# EAGLE schematic Z80_BMO_V1.2 (EAGLE 6.6.0)
DRAWING_NUMBER: S002_B003; DRAWN: Mario Blunk / Blunk electronic; PROJECT: System TRAIN-Z
Assembly variants: com_anodes, com_cathode

## Sheet 1 of 12
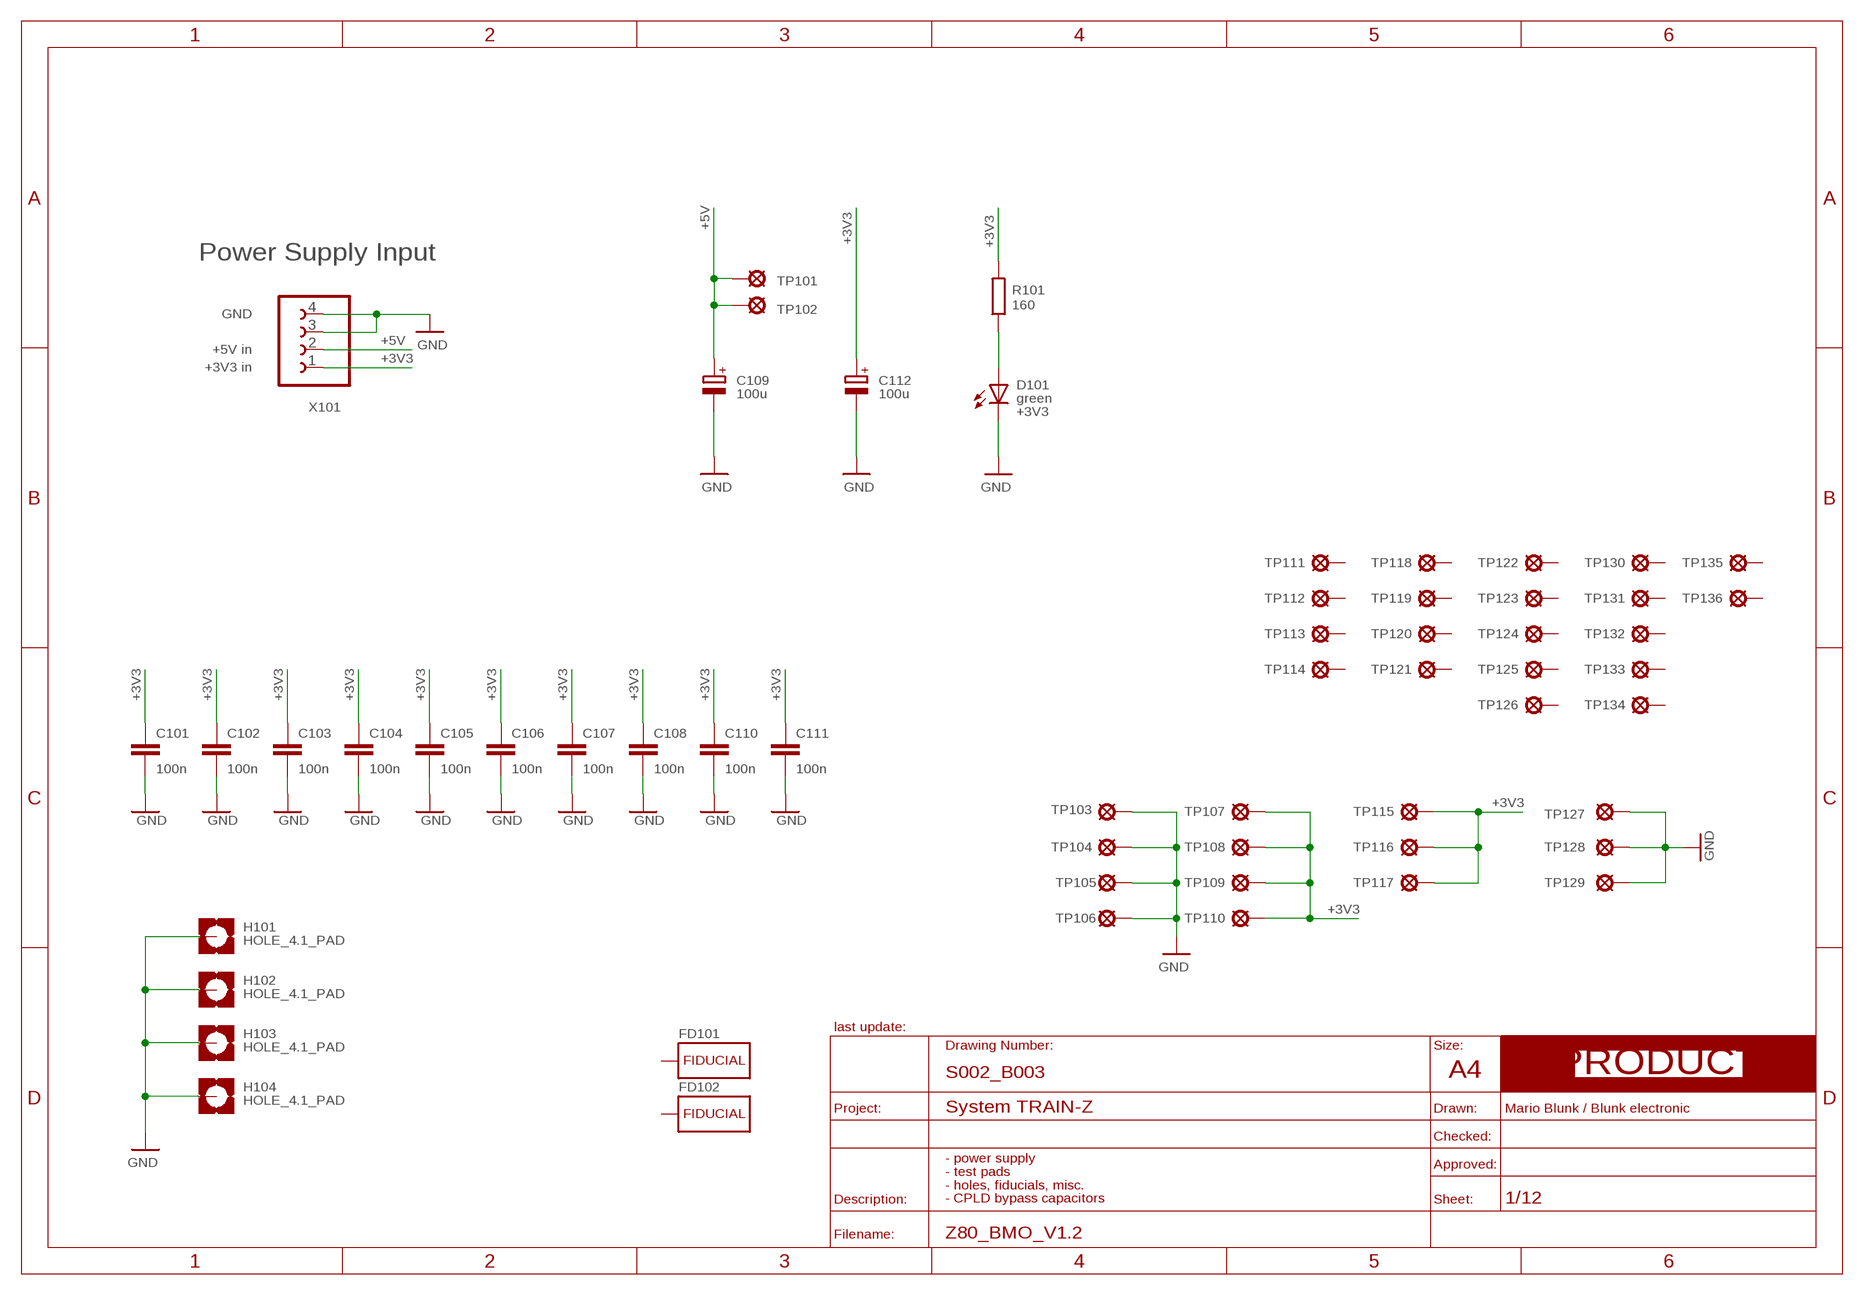
[diagram p0: schematic, sheet 1]
FRAME_PRODUCT1 (A4_LANDSCAPE_PRODUCT): BOM: NO; COMMISSIONED: 2013-08-30

### Parts
C101  100n  C_EU_S_0805  [S_0805]
C102  100n  C_EU_S_0805  [S_0805]
C103  100n  C_EU_S_0805  [S_0805]
C104  100n  C_EU_S_0805  [S_0805]
C105  100n  C_EU_S_0805  [S_0805]
C106  100n  C_EU_S_0805  [S_0805]
C107  100n  C_EU_S_0805  [S_0805]
C108  100n  C_EU_S_0805  [S_0805]
C109  100u  C_POL_EU_T_RAD7_GR2.54  [T_RADIAL_7MM_GRID_2.54MM]  (not fitted in variant com_anodes)  (not fitted in variant com_cathode)
C110  100n  C_EU_S_0805  [S_0805]
C111  100n  C_EU_S_0805  [S_0805]
C112  100u  C_POL_EU_T_RAD7_GR2.54  [T_RADIAL_7MM_GRID_2.54MM]
D101  green  LED_T_3MM  [T_LED_3MM]
FD101  FIDUCIAL_CROSSHAIR  [CROSSHAIR]
FD102  FIDUCIAL_CROSSHAIR  [CROSSHAIR]
H101  HOLE_4.1_PAD  [4.1_PAD]
H102  HOLE_4.1_PAD  [4.1_PAD]
H103  HOLE_4.1_PAD  [4.1_PAD]
H104  HOLE_4.1_PAD  [4.1_PAD]
R101  160  R_EU_T_0207_GRID10MM  [T_0207_GRID10MM]
TP101  TEST_POINT_T_SMALL  [T_TEST_POINT_SMALL]
TP102  TEST_POINT_T_SMALL  [T_TEST_POINT_SMALL]
TP103  TEST_POINT_T_SMALL  [T_TEST_POINT_SMALL]
TP104  TEST_POINT_T_SMALL  [T_TEST_POINT_SMALL]
TP105  TEST_POINT_T_SMALL  [T_TEST_POINT_SMALL]
TP106  TEST_POINT_T_SMALL  [T_TEST_POINT_SMALL]
TP107  TEST_POINT_T_SMALL  [T_TEST_POINT_SMALL]
TP108  TEST_POINT_T_SMALL  [T_TEST_POINT_SMALL]
TP109  TEST_POINT_T_SMALL  [T_TEST_POINT_SMALL]
TP110  TEST_POINT_T_SMALL  [T_TEST_POINT_SMALL]
TP111  TEST_POINT_T_SMALL  [T_TEST_POINT_SMALL]
TP112  TEST_POINT_T_SMALL  [T_TEST_POINT_SMALL]
TP113  TEST_POINT_T_SMALL  [T_TEST_POINT_SMALL]
TP114  TEST_POINT_T_SMALL  [T_TEST_POINT_SMALL]
TP115  TEST_POINT_T_SMALL  [T_TEST_POINT_SMALL]
TP116  TEST_POINT_T_SMALL  [T_TEST_POINT_SMALL]
TP117  TEST_POINT_T_SMALL  [T_TEST_POINT_SMALL]
TP118  TEST_POINT_T_SMALL  [T_TEST_POINT_SMALL]
TP119  TEST_POINT_T_SMALL  [T_TEST_POINT_SMALL]
TP120  TEST_POINT_T_SMALL  [T_TEST_POINT_SMALL]
TP121  TEST_POINT_T_SMALL  [T_TEST_POINT_SMALL]
TP122  TEST_POINT_T_SMALL  [T_TEST_POINT_SMALL]
TP123  TEST_POINT_T_SMALL  [T_TEST_POINT_SMALL]
TP124  TEST_POINT_T_SMALL  [T_TEST_POINT_SMALL]
TP125  TEST_POINT_T_SMALL  [T_TEST_POINT_SMALL]
TP126  TEST_POINT_T_SMALL  [T_TEST_POINT_SMALL]
TP127  TEST_POINT_T_SMALL  [T_TEST_POINT_SMALL]
TP128  TEST_POINT_T_SMALL  [T_TEST_POINT_SMALL]
TP129  TEST_POINT_T_SMALL  [T_TEST_POINT_SMALL]
TP130  TEST_POINT_T_SMALL  [T_TEST_POINT_SMALL]
TP131  TEST_POINT_T_SMALL  [T_TEST_POINT_SMALL]
TP132  TEST_POINT_T_SMALL  [T_TEST_POINT_SMALL]
TP133  TEST_POINT_T_SMALL  [T_TEST_POINT_SMALL]
TP134  TEST_POINT_T_SMALL  [T_TEST_POINT_SMALL]
TP135  TEST_POINT_T_SMALL  [T_TEST_POINT_SMALL]
TP136  TEST_POINT_T_SMALL  [T_TEST_POINT_SMALL]
X101  CLAMP_1X4-T-5MM  [T_WIRE_CLAMP_1X4_5MM]

### Nets
3V3_LED_A: D101.A R101.1
+3V3: C101.1 C102.1 C103.1 C104.1 C105.1 C106.1 C107.1 C108.1 C110.1 C111.1 C112.+ R101.2 TP107.1(MP) TP108.1(MP) TP109.1(MP) TP110.1(MP) TP115.1(MP) TP116.1(MP) TP117.1(MP) X101.1 ; also sheet 2,4,5,6,7,8,9,10,11,12
+5V: C109.+ TP101.1(MP) TP102.1(MP) X101.2
GND: C101.2 C102.2 C103.2 C104.2 C105.2 C106.2 C107.2 C108.2 C109.- C110.2 C111.2 C112.- D101.C H101.H1(MOUNT) H102.H1(MOUNT) H103.H1(MOUNT) H104.H1(MOUNT) TP103.1(MP) TP104.1(MP) TP105.1(MP) TP106.1(MP) TP127.1(MP) TP128.1(MP) TP129.1(MP) X101.3 X101.4 ; also sheet 2,5,6,7,8,9,10,11,12
Unconnected: FD101.1(NC) FD102.1(NC) TP111.1(MP) TP112.1(MP) TP113.1(MP) TP114.1(MP) TP118.1(MP) TP119.1(MP) TP120.1(MP) TP121.1(MP) TP122.1(MP) TP123.1(MP) TP124.1(MP) TP125.1(MP) TP126.1(MP) TP130.1(MP) TP131.1(MP) TP132.1(MP) TP133.1(MP) TP134.1(MP) TP135.1(MP) TP136.1(MP)

### Notes on the sheet
- GND
- +5V in
- +3V3 in
- - power supply
  - test pads
  - holes, fiducials, misc.
  - CPLD bypass capacitors

## Sheet 2 of 12
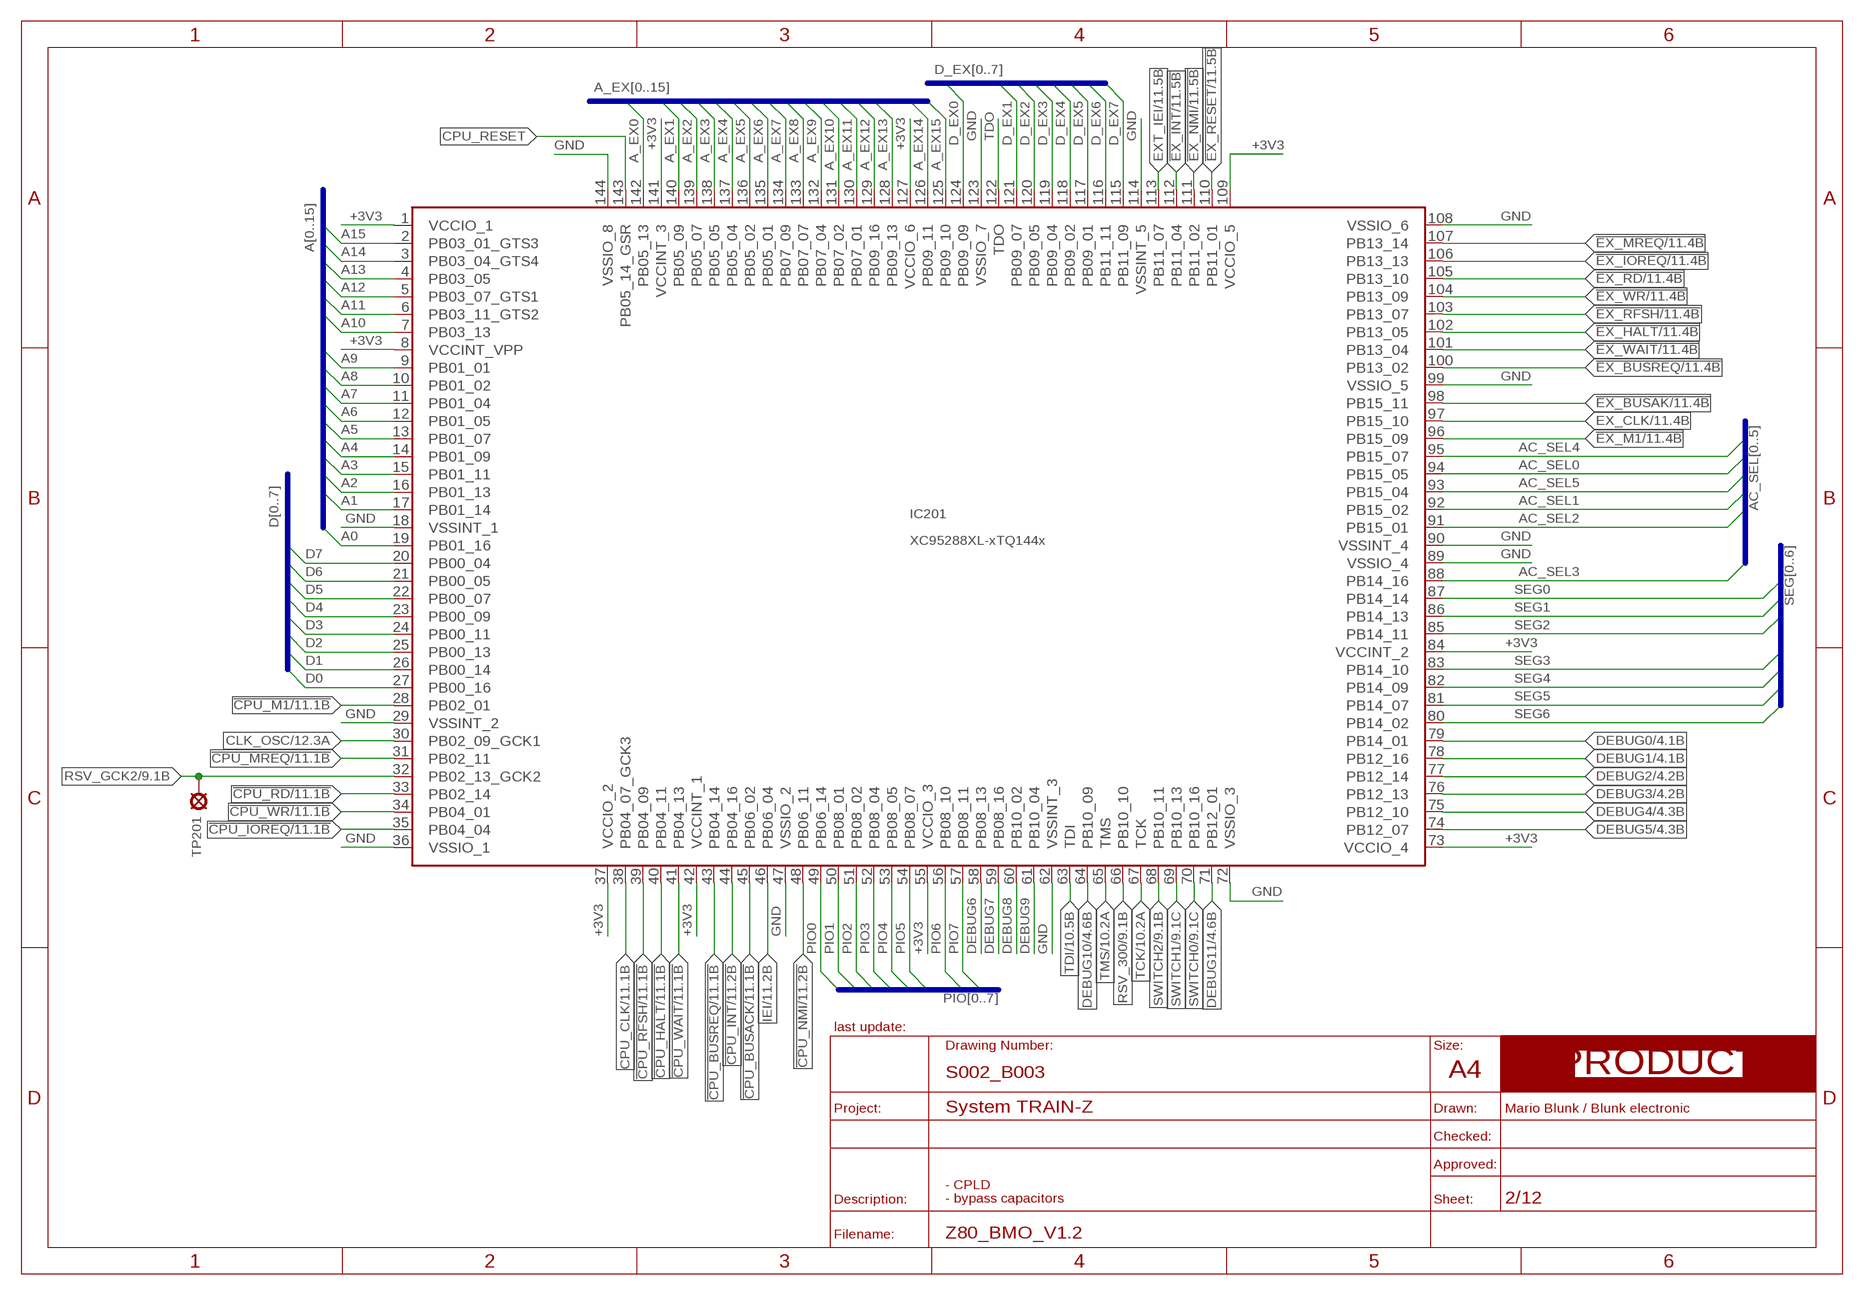
[diagram p1: schematic, sheet 2]
FRAME_PRODUCT4 (A4_LANDSCAPE_PRODUCT): BOM: NO; COMMISSIONED: 2013-08-30

### Parts
IC201  XC95288XL-xTQ144x  XC95288XL-TQG144  [S_TQFP144]
TP201  TEST_POINT_T_SMALL  [T_TEST_POINT_SMALL]

### Nets
!CPU_BUSACK: IC201.45(PB06_02) ; also sheet 11
!CPU_BUSREQ: IC201.43(PB04_14) ; also sheet 11
!CPU_HALT: IC201.40(PB04_11) ; also sheet 11
!CPU_INT: IC201.44(PB04_16) ; also sheet 11
!CPU_IOREQ: IC201.35(PB04_04) ; also sheet 11
!CPU_M1: IC201.28(PB02_01) ; also sheet 11
!CPU_MREQ: IC201.31(PB02_11) ; also sheet 11
!CPU_NMI: IC201.48(PB06_11) ; also sheet 11
!CPU_RD: IC201.33(PB02_14) ; also sheet 11
!CPU_RFSH: IC201.39(PB04_09) ; also sheet 11
!CPU_WAIT: IC201.41(PB04_13) ; also sheet 11
!CPU_WR: IC201.34(PB04_01) ; also sheet 11
!EX_BUSAK: IC201.98(PB15_11) ; also sheet 11
!EX_BUSREQ: IC201.100(PB13_02) ; also sheet 11
!EX_HALT: IC201.102(PB13_05) ; also sheet 11
!EX_INT: IC201.112(PB11_04) ; also sheet 11
!EX_IOREQ: IC201.106(PB13_13) ; also sheet 11
!EX_M1: IC201.96(PB15_09) ; also sheet 11
!EX_MREQ: IC201.107(PB13_14) ; also sheet 11
!EX_NMI: IC201.111(PB11_02) ; also sheet 11
!EX_RD: IC201.105(PB13_10) ; also sheet 11
!EX_RESET: IC201.110(PB11_01) ; also sheet 11
!EX_RFSH: IC201.103(PB13_07) ; also sheet 11
!EX_WAIT: IC201.101(PB13_04) ; also sheet 11
!EX_WR: IC201.104(PB13_09) ; also sheet 11
+3V3: IC201.1(VCCIO_1) IC201.8(VCCINT_VPP) IC201.37(VCCIO_2) IC201.42(VCCINT_1) IC201.55(VCCIO_3) IC201.73(VCCIO_4) IC201.84(VCCINT_2) IC201.109(VCCIO_5) IC201.127(VCCIO_6) IC201.141(VCCINT_3) ; also sheet 1,4,5,6,7,8,9,10,11,12
A0: IC201.19(PB01_16) ; also sheet 11
A1: IC201.17(PB01_14) ; also sheet 11
A2: IC201.16(PB01_13) ; also sheet 11
A3: IC201.15(PB01_11) ; also sheet 11
A4: IC201.14(PB01_09) ; also sheet 11
A5: IC201.13(PB01_07) ; also sheet 11
A6: IC201.12(PB01_05) ; also sheet 11
A7: IC201.11(PB01_04) ; also sheet 11
A8: IC201.10(PB01_02) ; also sheet 11
A9: IC201.9(PB01_01) ; also sheet 11
A10: IC201.7(PB03_13) ; also sheet 11
A11: IC201.6(PB03_11_GTS2) ; also sheet 11
A12: IC201.5(PB03_07_GTS1) ; also sheet 11
A13: IC201.4(PB03_05) ; also sheet 11
A14: IC201.3(PB03_04_GTS4) ; also sheet 11
A15: IC201.2(PB03_01_GTS3) ; also sheet 11
A_EX0: IC201.142(PB05_13) ; also sheet 11
A_EX1: IC201.140(PB05_09) ; also sheet 11
A_EX2: IC201.139(PB05_07) ; also sheet 11
A_EX3: IC201.138(PB05_05) ; also sheet 11
A_EX4: IC201.137(PB05_04) ; also sheet 11
A_EX5: IC201.136(PB05_02) ; also sheet 11
A_EX6: IC201.135(PB05_01) ; also sheet 11
A_EX7: IC201.134(PB07_09) ; also sheet 11
A_EX8: IC201.133(PB07_07) ; also sheet 11
A_EX9: IC201.132(PB07_04) ; also sheet 11
A_EX10: IC201.131(PB07_02) ; also sheet 11
A_EX11: IC201.130(PB07_01) ; also sheet 11
A_EX12: IC201.129(PB09_16) ; also sheet 11
A_EX13: IC201.128(PB09_13) ; also sheet 11
A_EX14: IC201.126(PB09_11) ; also sheet 11
A_EX15: IC201.125(PB09_10) ; also sheet 11
AC_SEL0: IC201.94(PB15_05) ; also sheet 8
AC_SEL1: IC201.92(PB15_02) ; also sheet 8
AC_SEL2: IC201.91(PB15_01) ; also sheet 8
AC_SEL3: IC201.88(PB14_16) ; also sheet 7
AC_SEL4: IC201.95(PB15_07) ; also sheet 7
AC_SEL5: IC201.93(PB15_04) ; also sheet 7
CLK_OSC: IC201.30(PB02_09_GCK1) ; also sheet 12
CPU_CLK: IC201.38(PB04_07_GCK3) ; also sheet 11
CPU_RESET: IC201.143(PB05_14_GSR) ; also sheet 11
D0: IC201.27(PB00_16) ; also sheet 11
D1: IC201.26(PB00_14) ; also sheet 11
D2: IC201.25(PB00_13) ; also sheet 11
D3: IC201.24(PB00_11) ; also sheet 11
D4: IC201.23(PB00_09) ; also sheet 11
D5: IC201.22(PB00_07) ; also sheet 11
D6: IC201.21(PB00_05) ; also sheet 11
D7: IC201.20(PB00_04) ; also sheet 11
D_EX0: IC201.124(PB09_09) ; also sheet 11
D_EX1: IC201.121(PB09_07) ; also sheet 11
D_EX2: IC201.120(PB09_05) ; also sheet 11
D_EX3: IC201.119(PB09_04) ; also sheet 11
D_EX4: IC201.118(PB09_02) ; also sheet 11
D_EX5: IC201.117(PB09_01) ; also sheet 11
D_EX6: IC201.116(PB11_11) ; also sheet 11
D_EX7: IC201.115(PB11_09) ; also sheet 11
DEBUG0: IC201.79(PB14_01) ; also sheet 4,9
DEBUG1: IC201.78(PB12_16) ; also sheet 4,9
DEBUG2: IC201.77(PB12_14) ; also sheet 4,9
DEBUG3: IC201.76(PB12_13) ; also sheet 4,9
DEBUG4: IC201.75(PB12_10) ; also sheet 4,9
DEBUG5: IC201.74(PB12_07) ; also sheet 4,9
DEBUG6: IC201.58(PB08_13) ; also sheet 4,9
DEBUG7: IC201.59(PB08_16) ; also sheet 4,9
DEBUG8: IC201.60(PB10_02) ; also sheet 4
DEBUG9: IC201.61(PB10_04) ; also sheet 4
DEBUG10: IC201.64(PB10_09) ; also sheet 4
DEBUG11: IC201.71(PB12_01) ; also sheet 4
EX_CLK: IC201.97(PB15_10) ; also sheet 11
EXT_IEI: IC201.113(PB11_07) ; also sheet 11
GND: IC201.18(VSSINT_1) IC201.29(VSSINT_2) IC201.36(VSSIO_1) IC201.47(VSSIO_2) IC201.62(VSSINT_3) IC201.72(VSSIO_3) IC201.89(VSSIO_4) IC201.90(VSSINT_4) IC201.99(VSSIO_5) IC201.108(VSSIO_6) IC201.114(VSSINT_5) IC201.123(VSSIO_7) IC201.144(VSSIO_8) ; also sheet 1,5,6,7,8,9,10,11,12
IEI: IC201.46(PB06_04) ; also sheet 11
PIO0: IC201.49(PB06_14) ; also sheet 9
PIO1: IC201.50(PB08_01) ; also sheet 9
PIO2: IC201.51(PB08_02) ; also sheet 9
PIO3: IC201.52(PB08_04) ; also sheet 9
PIO4: IC201.53(PB08_05) ; also sheet 9
PIO5: IC201.54(PB08_07) ; also sheet 9
PIO6: IC201.56(PB08_10) ; also sheet 9
PIO7: IC201.57(PB08_11) ; also sheet 9
RSV_300: IC201.66(PB10_10) ; also sheet 9
RSV_GCK2: IC201.32(PB02_13_GCK2) TP201.1(MP) ; also sheet 9
SEG0: IC201.87(PB14_14) ; also sheet 5
SEG1: IC201.86(PB14_13) ; also sheet 5
SEG2: IC201.85(PB14_11) ; also sheet 5
SEG3: IC201.83(PB14_10) ; also sheet 5
SEG4: IC201.82(PB14_09) ; also sheet 6
SEG5: IC201.81(PB14_07) ; also sheet 6
SEG6: IC201.80(PB14_02) ; also sheet 6
SWITCH0: IC201.70(PB10_16) ; also sheet 9
SWITCH1: IC201.69(PB10_13) ; also sheet 9
SWITCH2: IC201.68(PB10_11) ; also sheet 9
TCK: IC201.67(TCK) ; also sheet 10
TDI: IC201.63(TDI) ; also sheet 10
TDO: IC201.122(TDO) ; also sheet 10
TMS: IC201.65(TMS) ; also sheet 10

### Buses
A[0..15]
D[0..7]
D_EX[0..7]
A_EX[0..15]
PIO[0..7]
SEG[0..6]
AC_SEL[0..5]

### Notes on the sheet
- - CPLD
  - bypass capacitors

## Sheet 3 of 12
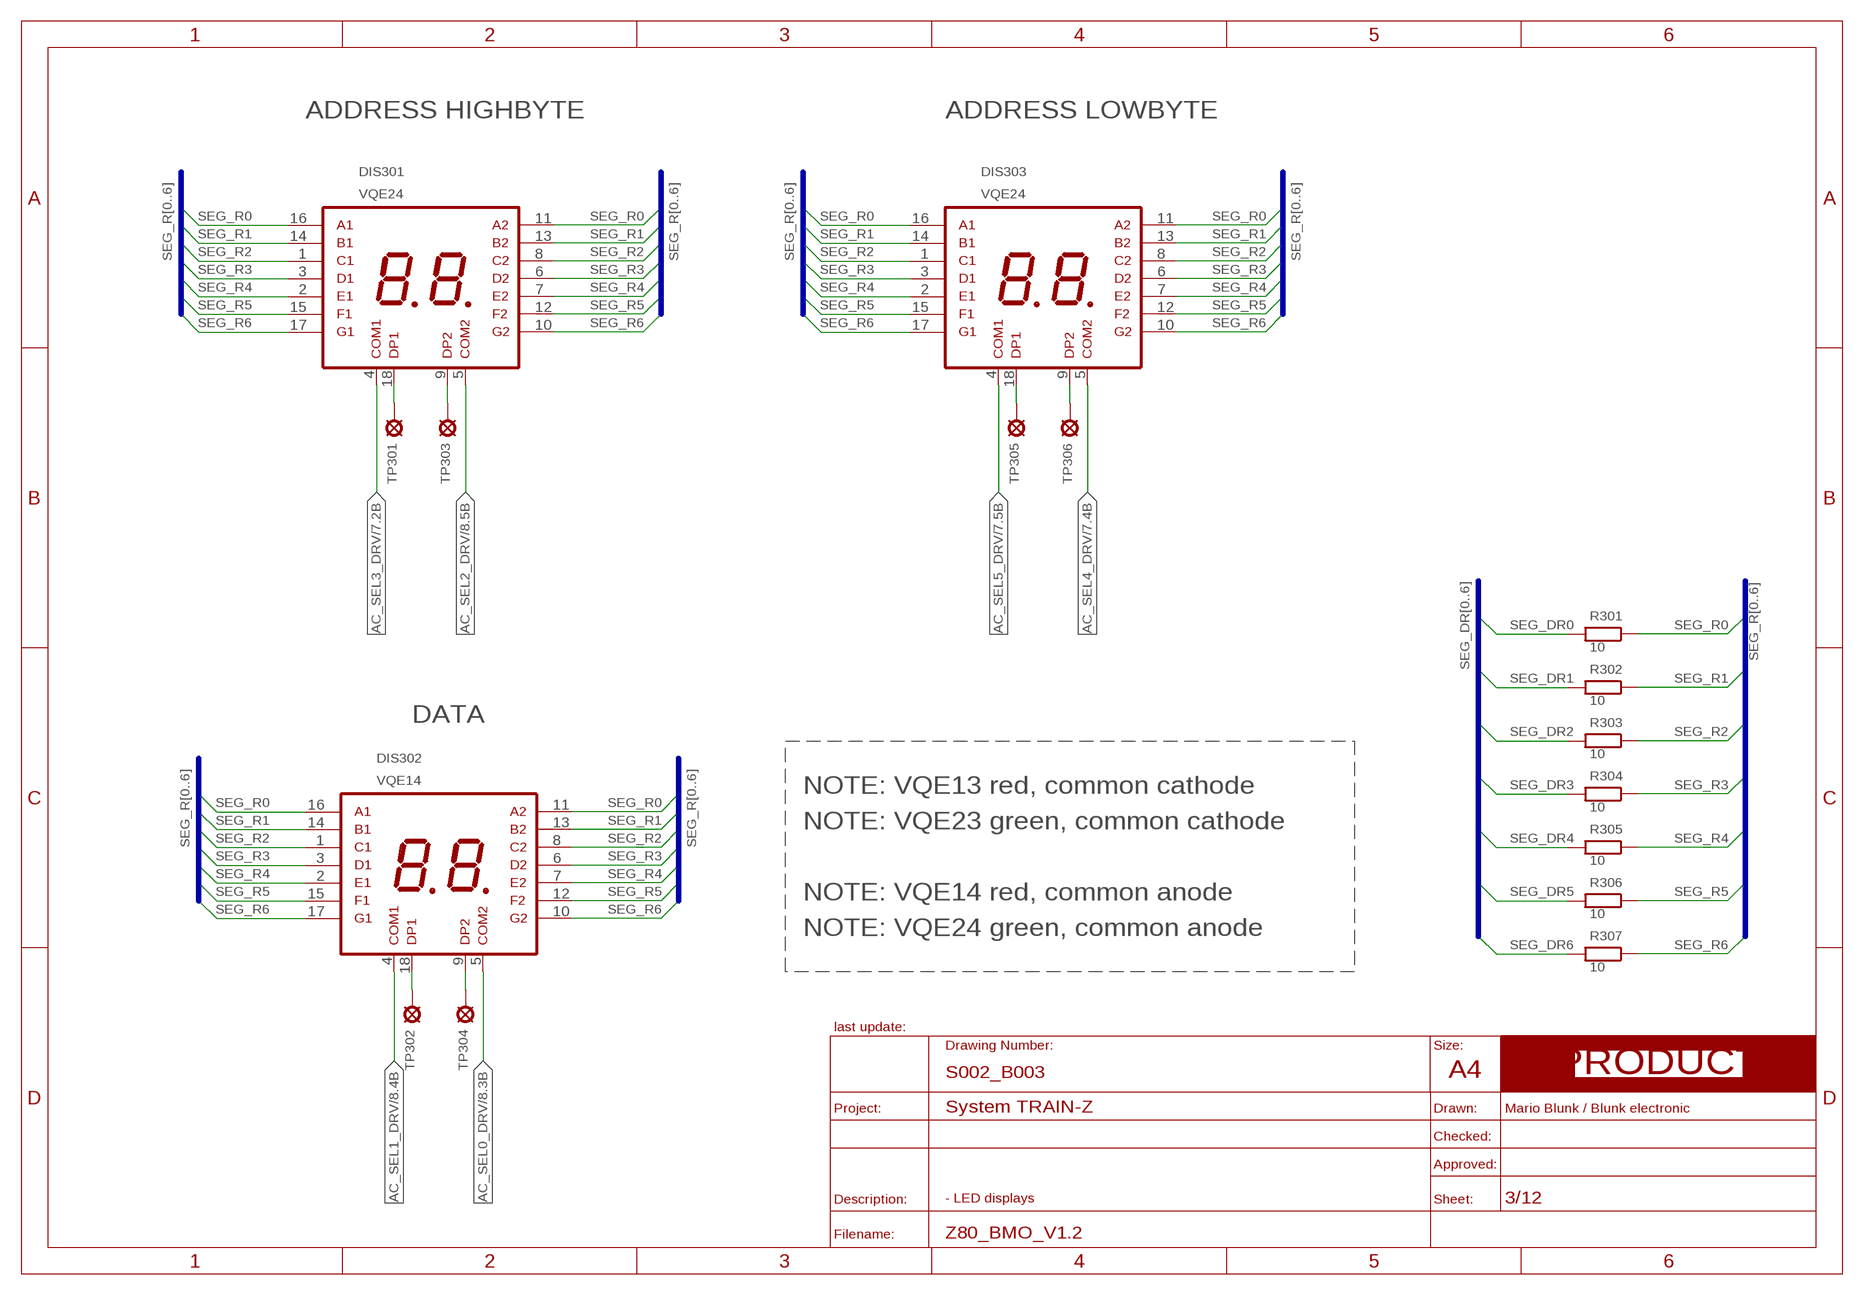
[diagram p2: schematic, sheet 3]
FRAME_PRODUCT5 (A4_LANDSCAPE_PRODUCT): BOM: NO; COMMISSIONED: 2013-08-30

### Parts
DIS301  VQE24  VQEXX_2DIGIT_T_VQEXX_2DIGIT  [T_VQE_XX_2DIGIT]
DIS302  VQE14  VQEXX_2DIGIT_T_VQEXX_2DIGIT  [T_VQE_XX_2DIGIT]
DIS303  VQE24  VQEXX_2DIGIT_T_VQEXX_2DIGIT  [T_VQE_XX_2DIGIT]
R301  10  R_EU_T_0207_GRID10MM  [T_0207_GRID10MM]
R302  10  R_EU_T_0207_GRID10MM  [T_0207_GRID10MM]
R303  10  R_EU_T_0207_GRID10MM  [T_0207_GRID10MM]
R304  10  R_EU_T_0207_GRID10MM  [T_0207_GRID10MM]
R305  10  R_EU_T_0207_GRID10MM  [T_0207_GRID10MM]
R306  10  R_EU_T_0207_GRID10MM  [T_0207_GRID10MM]
R307  10  R_EU_T_0207_GRID10MM  [T_0207_GRID10MM]
TP301  TEST_POINT_T_SMALL  [T_TEST_POINT_SMALL]
TP302  TEST_POINT_T_SMALL  [T_TEST_POINT_SMALL]
TP303  TEST_POINT_T_SMALL  [T_TEST_POINT_SMALL]
TP304  TEST_POINT_T_SMALL  [T_TEST_POINT_SMALL]
TP305  TEST_POINT_T_SMALL  [T_TEST_POINT_SMALL]
TP306  TEST_POINT_T_SMALL  [T_TEST_POINT_SMALL]

### Nets
AC_SEL0_DRV [PWR]: DIS302.5(COM2) ; also sheet 8
AC_SEL1_DRV [PWR]: DIS302.4(COM1) ; also sheet 8
AC_SEL2_DRV [PWR]: DIS301.5(COM2) ; also sheet 8
AC_SEL3_DRV [PWR]: DIS301.4(COM1) ; also sheet 7
AC_SEL4_DRV [PWR]: DIS303.5(COM2) ; also sheet 7
AC_SEL5_DRV [PWR]: DIS303.4(COM1) ; also sheet 7
N$1: DIS303.9(DP2) TP306.1(MP)
N$2: DIS303.18(DP1) TP305.1(MP)
N$3: DIS301.9(DP2) TP303.1(MP)
N$4: DIS301.18(DP1) TP301.1(MP)
N$5: DIS302.9(DP2) TP304.1(MP)
N$6: DIS302.18(DP1) TP302.1(MP)
SEG_DR0: R301.2 ; also sheet 5
SEG_DR1: R302.2 ; also sheet 5
SEG_DR2: R303.2 ; also sheet 5
SEG_DR3: R304.2 ; also sheet 5
SEG_DR4: R305.2 ; also sheet 6
SEG_DR5: R306.2 ; also sheet 6
SEG_DR6: R307.2 ; also sheet 6
SEG_R0: DIS301.11(A2) DIS301.16(A1) DIS302.11(A2) DIS302.16(A1) DIS303.11(A2) DIS303.16(A1) R301.1
SEG_R1: DIS301.13(B2) DIS301.14(B1) DIS302.13(B2) DIS302.14(B1) DIS303.13(B2) DIS303.14(B1) R302.1
SEG_R2: DIS301.1(C1) DIS301.8(C2) DIS302.1(C1) DIS302.8(C2) DIS303.1(C1) DIS303.8(C2) R303.1
SEG_R3: DIS301.3(D1) DIS301.6(D2) DIS302.3(D1) DIS302.6(D2) DIS303.3(D1) DIS303.6(D2) R304.1
SEG_R4: DIS301.2(E1) DIS301.7(E2) DIS302.2(E1) DIS302.7(E2) DIS303.2(E1) DIS303.7(E2) R305.1
SEG_R5: DIS301.12(F2) DIS301.15(F1) DIS302.12(F2) DIS302.15(F1) DIS303.12(F2) DIS303.15(F1) R306.1
SEG_R6: DIS301.10(G2) DIS301.17(G1) DIS302.10(G2) DIS302.17(G1) DIS303.10(G2) DIS303.17(G1) R307.1

### Buses
SEG_R[0..6]
SEG_DR[0..6]

### Notes on the sheet
- ADDRESS HIGHBYTE | ADDRESS LOWBYTE
- DATA
- NOTE: VQE13 red, common cathode
- NOTE: VQE23 green, common cathode
- NOTE: VQE14 red, common anode
- NOTE: VQE24 green, common anode
- - LED displays

## Sheet 4 of 12
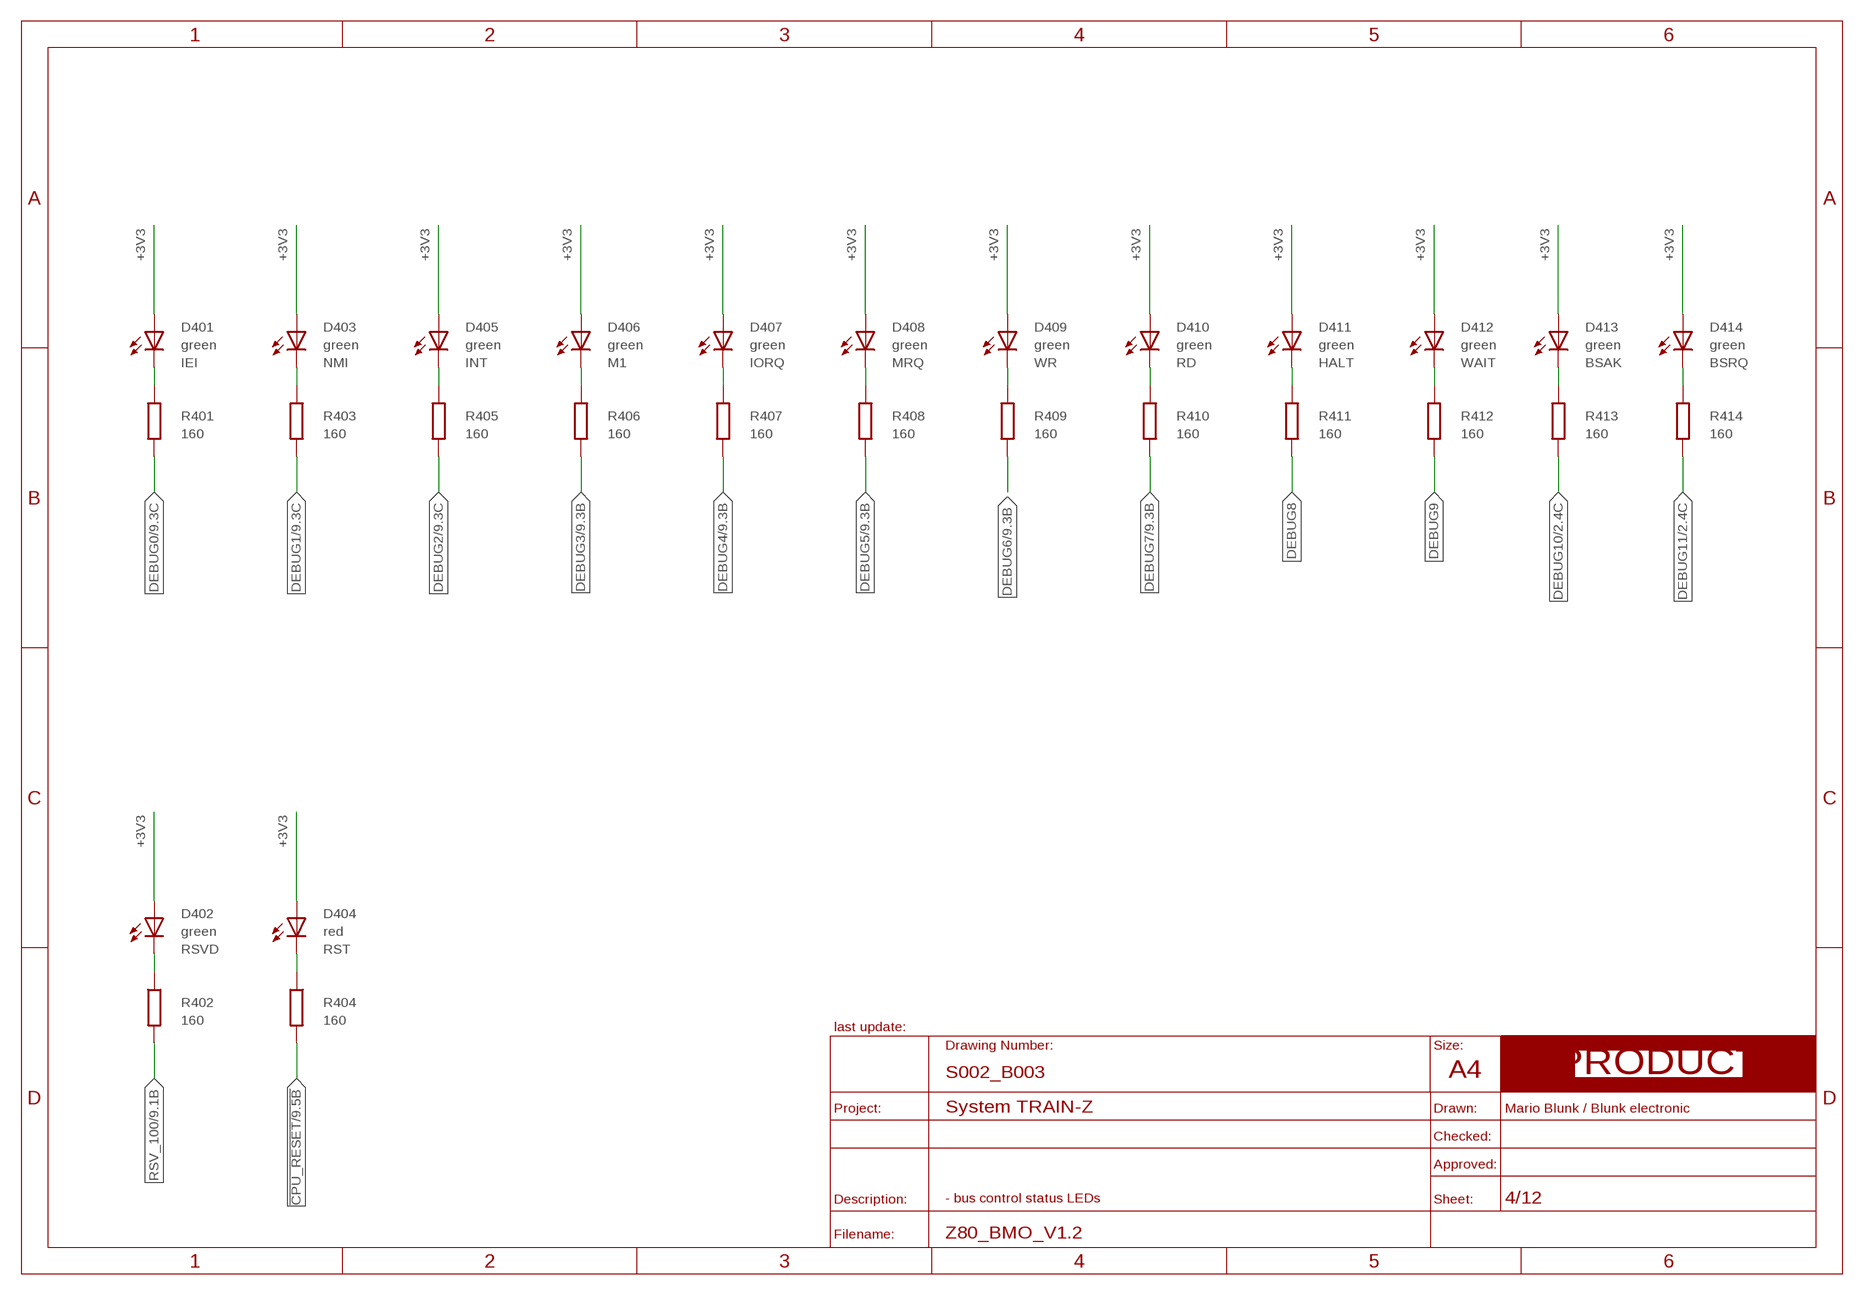
[diagram p3: schematic, sheet 4]
FRAME_PRODUCT6 (A4_LANDSCAPE_PRODUCT): BOM: NO; COMMISSIONED: 2013-08-30

### Parts
D401  green  LED_T_3MM  [T_LED_3MM]
D402  green  LED_T_3MM  [T_LED_3MM]
D403  green  LED_T_3MM  [T_LED_3MM]
D404  red  LED_T_3MM  [T_LED_3MM]
D405  green  LED_T_3MM  [T_LED_3MM]
D406  green  LED_T_3MM  [T_LED_3MM]
D407  green  LED_T_3MM  [T_LED_3MM]
D408  green  LED_T_3MM  [T_LED_3MM]
D409  green  LED_T_3MM  [T_LED_3MM]
D410  green  LED_T_3MM  [T_LED_3MM]
D411  green  LED_T_3MM  [T_LED_3MM]
D412  green  LED_T_3MM  [T_LED_3MM]
D413  green  LED_T_3MM  [T_LED_3MM]
D414  green  LED_T_3MM  [T_LED_3MM]
R401  160  R_EU_T_0207_GRID10MM  [T_0207_GRID10MM]
R402  160  R_EU_T_0207_GRID10MM  [T_0207_GRID10MM]
R403  160  R_EU_T_0207_GRID10MM  [T_0207_GRID10MM]
R404  160  R_EU_T_0207_GRID10MM  [T_0207_GRID10MM]
R405  160  R_EU_T_0207_GRID10MM  [T_0207_GRID10MM]
R406  160  R_EU_T_0207_GRID10MM  [T_0207_GRID10MM]
R407  160  R_EU_T_0207_GRID10MM  [T_0207_GRID10MM]
R408  160  R_EU_T_0207_GRID10MM  [T_0207_GRID10MM]
R409  160  R_EU_T_0207_GRID10MM  [T_0207_GRID10MM]
R410  160  R_EU_T_0207_GRID10MM  [T_0207_GRID10MM]
R411  160  R_EU_T_0207_GRID10MM  [T_0207_GRID10MM]
R412  160  R_EU_T_0207_GRID10MM  [T_0207_GRID10MM]
R413  160  R_EU_T_0207_GRID10MM  [T_0207_GRID10MM]
R414  160  R_EU_T_0207_GRID10MM  [T_0207_GRID10MM]

### Nets
!CPU_RESET: R404.2 ; also sheet 9,11
+3V3: D401.A D402.A D403.A D404.A D405.A D406.A D407.A D408.A D409.A D410.A D411.A D412.A D413.A D414.A ; also sheet 1,2,5,6,7,8,9,10,11,12
DEBUG0: R401.2 ; also sheet 2,9
DEBUG0_LED: D401.C R401.1
DEBUG1: R403.2 ; also sheet 2,9
DEBUG1_LED: D403.C R403.1
DEBUG2: R405.2 ; also sheet 2,9
DEBUG2_LED: D405.C R405.1
DEBUG3: R406.2 ; also sheet 2,9
DEBUG3_LED: D406.C R406.1
DEBUG4: R407.2 ; also sheet 2,9
DEBUG4_LED: D407.C R407.1
DEBUG5: R408.2 ; also sheet 2,9
DEBUG5_LED: D408.C R408.1
DEBUG6: R409.2 ; also sheet 2,9
DEBUG6_LED: D409.C R409.1
DEBUG7: R410.2 ; also sheet 2,9
DEBUG7_LED: D410.C R410.1
DEBUG8: R411.2 ; also sheet 2
DEBUG8_LED: D411.C R411.1
DEBUG9: R412.2 ; also sheet 2
DEBUG9_LED: D412.C R412.1
DEBUG10: R413.2 ; also sheet 2
DEBUG10_LED: D413.C R413.1
DEBUG11: R414.2 ; also sheet 2
DEBUG11_LED: D414.C R414.1
RST_LED_C: D404.C R404.1
RSV_100: R402.2 ; also sheet 9
RSV_100_LED: D402.C R402.1

### Notes on the sheet
- - bus control status LEDs

## Sheet 5 of 12
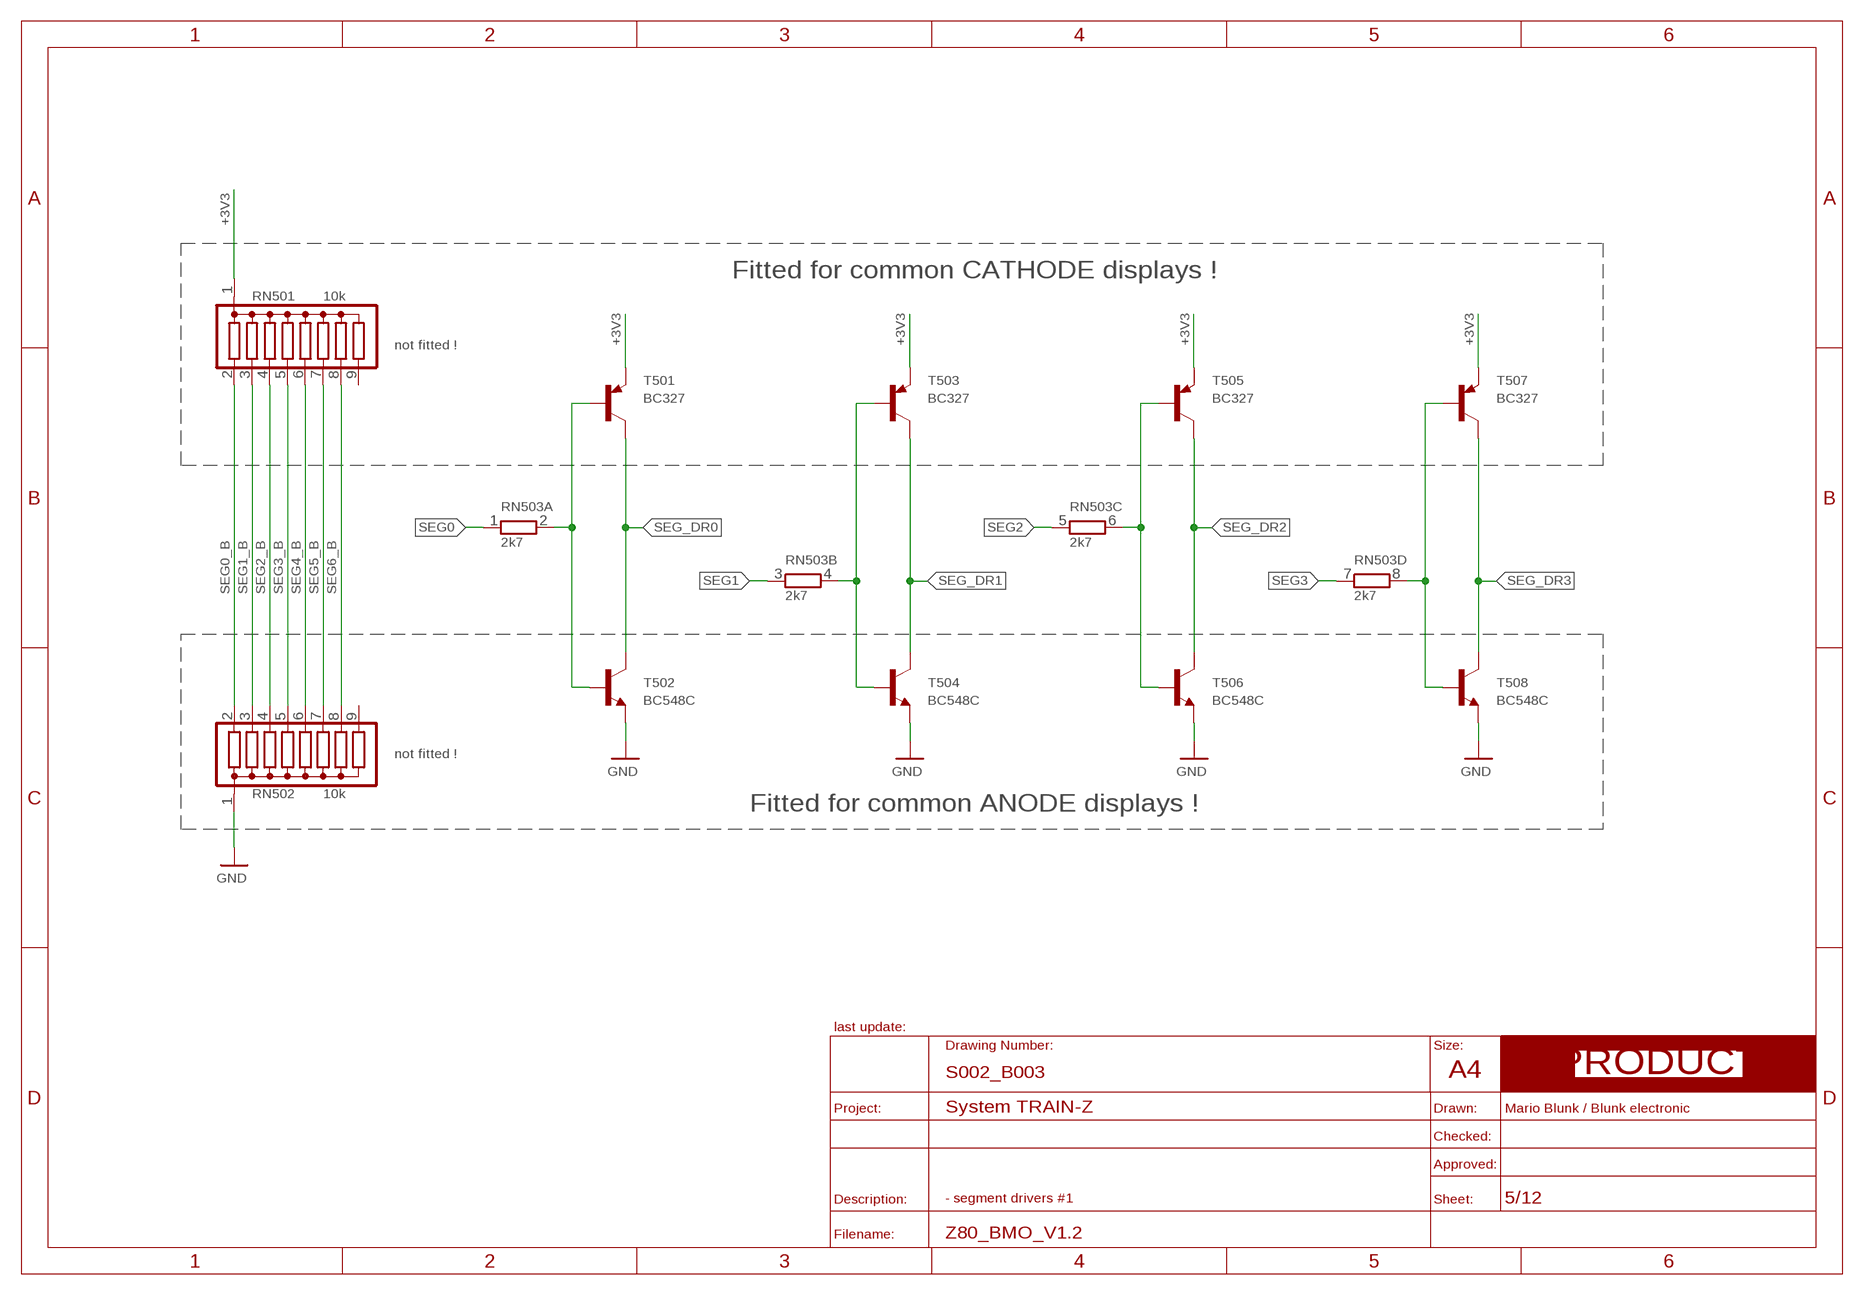
[diagram p4: schematic, sheet 5]
FRAME_PRODUCT8 (A4_LANDSCAPE_PRODUCT): BOM: NO; COMMISSIONED: 2013-08-30

### Parts
RN501  10k  R_EU_ARRAY_1C_8_T_SIL9  [T_SIL9]  (not fitted in variant com_anodes)  (not fitted in variant com_cathode)
RN502  10k  R_EU_ARRAY_1C_8_T_SIL9  [T_SIL9]  (not fitted in variant com_anodes)  (not fitted in variant com_cathode)
RN503  2k7  R_EU_ARRAY_4  [T_SIL8]
T501  BC327  PNP_T_TO92-CBE  [T_TO92-CBE]  (not fitted in variant com_anodes)
T502  BC548C  NPN_T_TO92-CBE  [T_TO92-CBE]  (not fitted in variant com_cathode)
T503  BC327  PNP_T_TO92-CBE  [T_TO92-CBE]  (not fitted in variant com_anodes)
T504  BC548C  NPN_T_TO92-CBE  [T_TO92-CBE]  (not fitted in variant com_cathode)
T505  BC327  PNP_T_TO92-CBE  [T_TO92-CBE]  (not fitted in variant com_anodes)
T506  BC548C  NPN_T_TO92-CBE  [T_TO92-CBE]  (not fitted in variant com_cathode)
T507  BC327  PNP_T_TO92-CBE  [T_TO92-CBE]  (not fitted in variant com_anodes)
T508  BC548C  NPN_T_TO92-CBE  [T_TO92-CBE]  (not fitted in variant com_cathode)

### Nets
+3V3: RN501.1 T501.E T503.E T505.E T507.E ; also sheet 1,2,4,6,7,8,9,10,11,12
GND: RN502.1 T502.E T504.E T506.E T508.E ; also sheet 1,2,6,7,8,9,10,11,12
SEG0: RN503.1 ; also sheet 2
SEG0_B: RN501.2 RN502.2 RN503.2 T501.B T502.B
SEG1: RN503.3 ; also sheet 2
SEG1_B: RN501.3 RN502.3 RN503.4 T503.B T504.B
SEG2: RN503.5 ; also sheet 2
SEG2_B: RN501.4 RN502.4 RN503.6 T505.B T506.B
SEG3: RN503.7 ; also sheet 2
SEG3_B: RN501.5 RN502.5 RN503.8 T507.B T508.B
SEG4_B: RN501.6 RN502.6 ; also sheet 6
SEG5_B: RN501.7 RN502.7 ; also sheet 6
SEG6_B: RN501.8 RN502.8 ; also sheet 6
SEG_DR0: T501.C T502.C ; also sheet 3
SEG_DR1: T503.C T504.C ; also sheet 3
SEG_DR2: T505.C T506.C ; also sheet 3
SEG_DR3: T507.C T508.C ; also sheet 3
Unconnected: RN501.9 RN502.9

### Notes on the sheet
- Fitted for common CATHODE displays !
- not fitted !
- not fitted !
- Fitted for common ANODE displays !
- - segment drivers #1

## Sheet 6 of 12
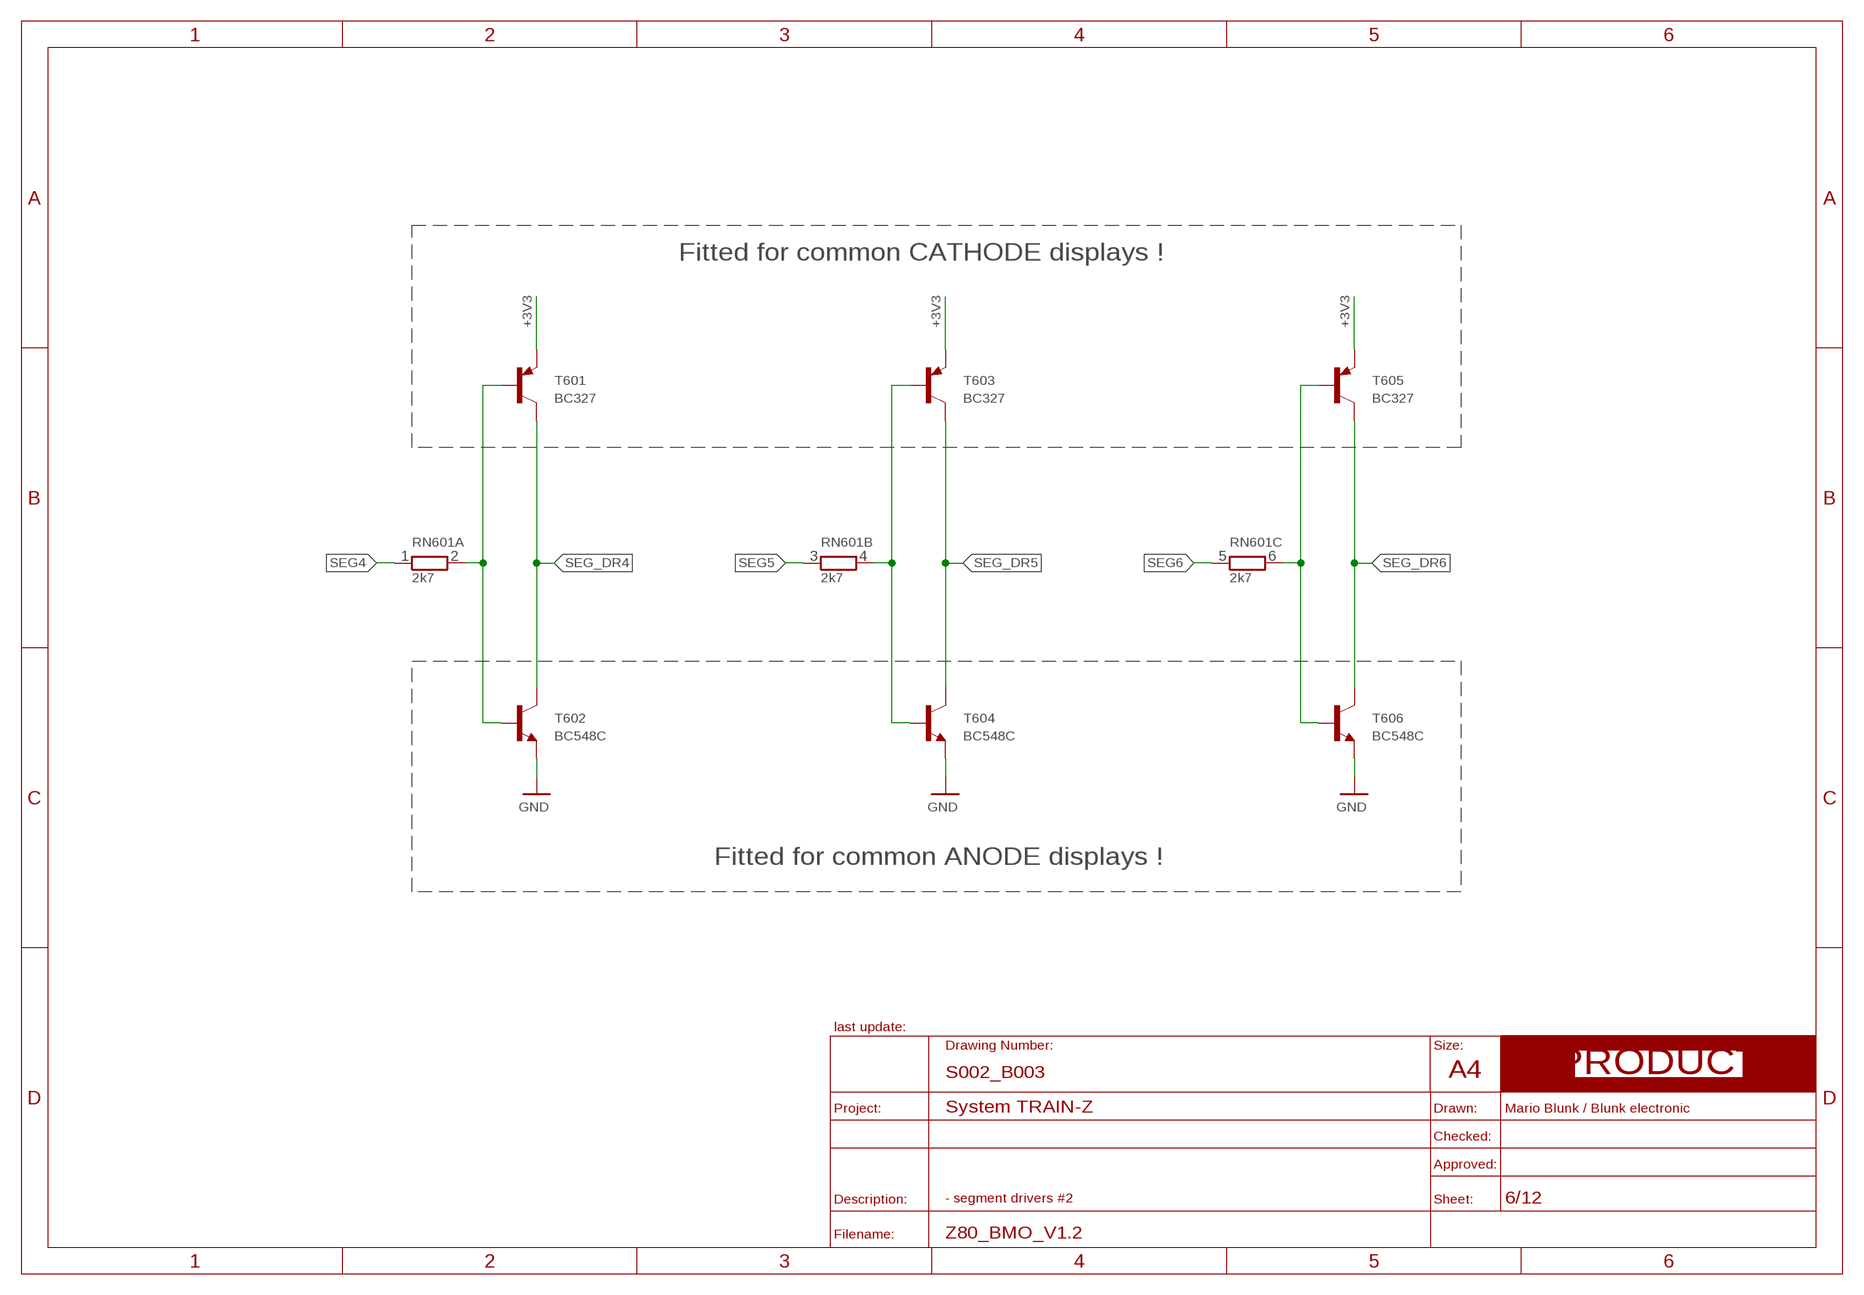
[diagram p5: schematic, sheet 6]
FRAME_PRODUCT7 (A4_LANDSCAPE_PRODUCT): BOM: NO; COMMISSIONED: 2013-08-30

### Parts
RN601  2k7  R_EU_ARRAY_4  [T_SIL8]
T601  BC327  PNP_T_TO92-CBE  [T_TO92-CBE]  (not fitted in variant com_anodes)
T602  BC548C  NPN_T_TO92-CBE  [T_TO92-CBE]  (not fitted in variant com_cathode)
T603  BC327  PNP_T_TO92-CBE  [T_TO92-CBE]  (not fitted in variant com_anodes)
T604  BC548C  NPN_T_TO92-CBE  [T_TO92-CBE]  (not fitted in variant com_cathode)
T605  BC327  PNP_T_TO92-CBE  [T_TO92-CBE]  (not fitted in variant com_anodes)
T606  BC548C  NPN_T_TO92-CBE  [T_TO92-CBE]  (not fitted in variant com_cathode)

### Nets
+3V3: T601.E T603.E T605.E ; also sheet 1,2,4,5,7,8,9,10,11,12
GND: T602.E T604.E T606.E ; also sheet 1,2,5,7,8,9,10,11,12
SEG4: RN601.1 ; also sheet 2
SEG4_B: RN601.2 T601.B T602.B ; also sheet 5
SEG5: RN601.3 ; also sheet 2
SEG5_B: RN601.4 T603.B T604.B ; also sheet 5
SEG6: RN601.5 ; also sheet 2
SEG6_B: RN601.6 T605.B T606.B ; also sheet 5
SEG_DR4: T601.C T602.C ; also sheet 3
SEG_DR5: T603.C T604.C ; also sheet 3
SEG_DR6: T605.C T606.C ; also sheet 3
Unconnected: RN601.7 RN601.8

### Notes on the sheet
- Fitted for common CATHODE displays !
- Fitted for common ANODE displays !
- - segment drivers #2

## Sheet 7 of 12
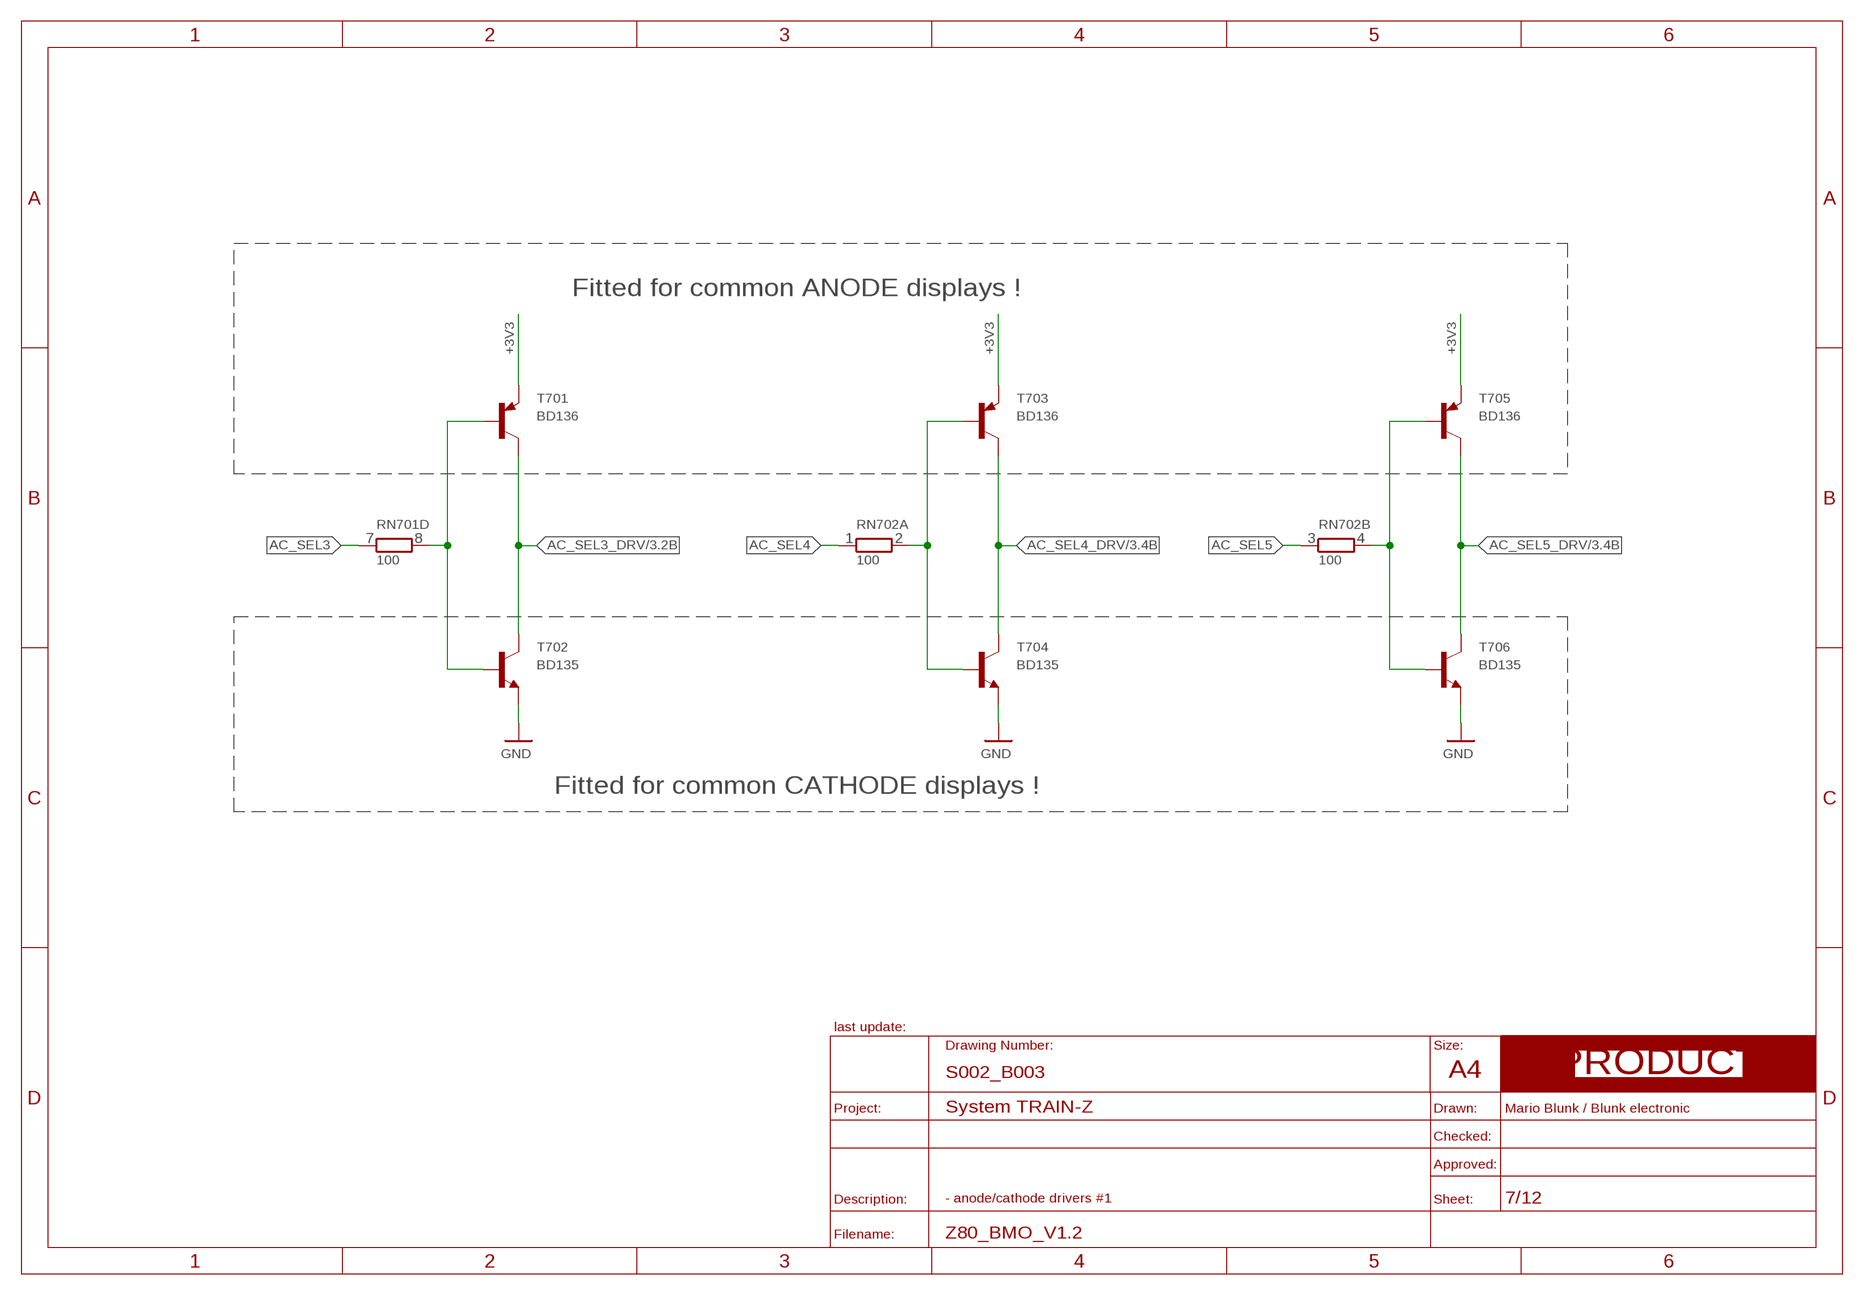
[diagram p6: schematic, sheet 7]
FRAME_PRODUCT10 (A4_LANDSCAPE_PRODUCT): BOM: NO; COMMISSIONED: 2013-08-30

### Parts
RN701  100  R_EU_ARRAY_4  [T_SIL8]
RN702  100  R_EU_ARRAY_4  [T_SIL8]
T701  BD136  PNP_T_TO126_VERTICAL  [T_TO126_VERTICAL]  (not fitted in variant com_cathode)
T702  BD135  NPN_T_TO126_VERTICAL  [T_TO126_VERTICAL]  (not fitted in variant com_anodes)
T703  BD136  PNP_T_TO126_VERTICAL  [T_TO126_VERTICAL]  (not fitted in variant com_cathode)
T704  BD135  NPN_T_TO126_VERTICAL  [T_TO126_VERTICAL]  (not fitted in variant com_anodes)
T705  BD136  PNP_T_TO126_VERTICAL  [T_TO126_VERTICAL]  (not fitted in variant com_cathode)
T706  BD135  NPN_T_TO126_VERTICAL  [T_TO126_VERTICAL]  (not fitted in variant com_anodes)

### Nets
+3V3: T701.E T703.E T705.E ; also sheet 1,2,4,5,6,8,9,10,11,12
AC_SEL3: RN701.7 ; also sheet 2
AC_SEL3_DRV [PWR]: T701.C T702.C ; also sheet 3
AC_SEL4: RN702.1 ; also sheet 2
AC_SEL4_DRV [PWR]: T703.C T704.C ; also sheet 3
AC_SEL5: RN702.3 ; also sheet 2
AC_SEL5_DRV [PWR]: T705.C T706.C ; also sheet 3
AC_SEL_B3: RN701.8 T701.B T702.B ; also sheet 8
AC_SEL_B4: RN702.2 T703.B T704.B ; also sheet 8
AC_SEL_B5: RN702.4 T705.B T706.B ; also sheet 8
GND: T702.E T704.E T706.E ; also sheet 1,2,5,6,8,9,10,11,12
Unconnected: RN702.5 RN702.6 RN702.7 RN702.8

### Notes on the sheet
- Fitted for common ANODE displays !
- Fitted for common CATHODE displays !
- - anode/cathode drivers #1

## Sheet 8 of 12
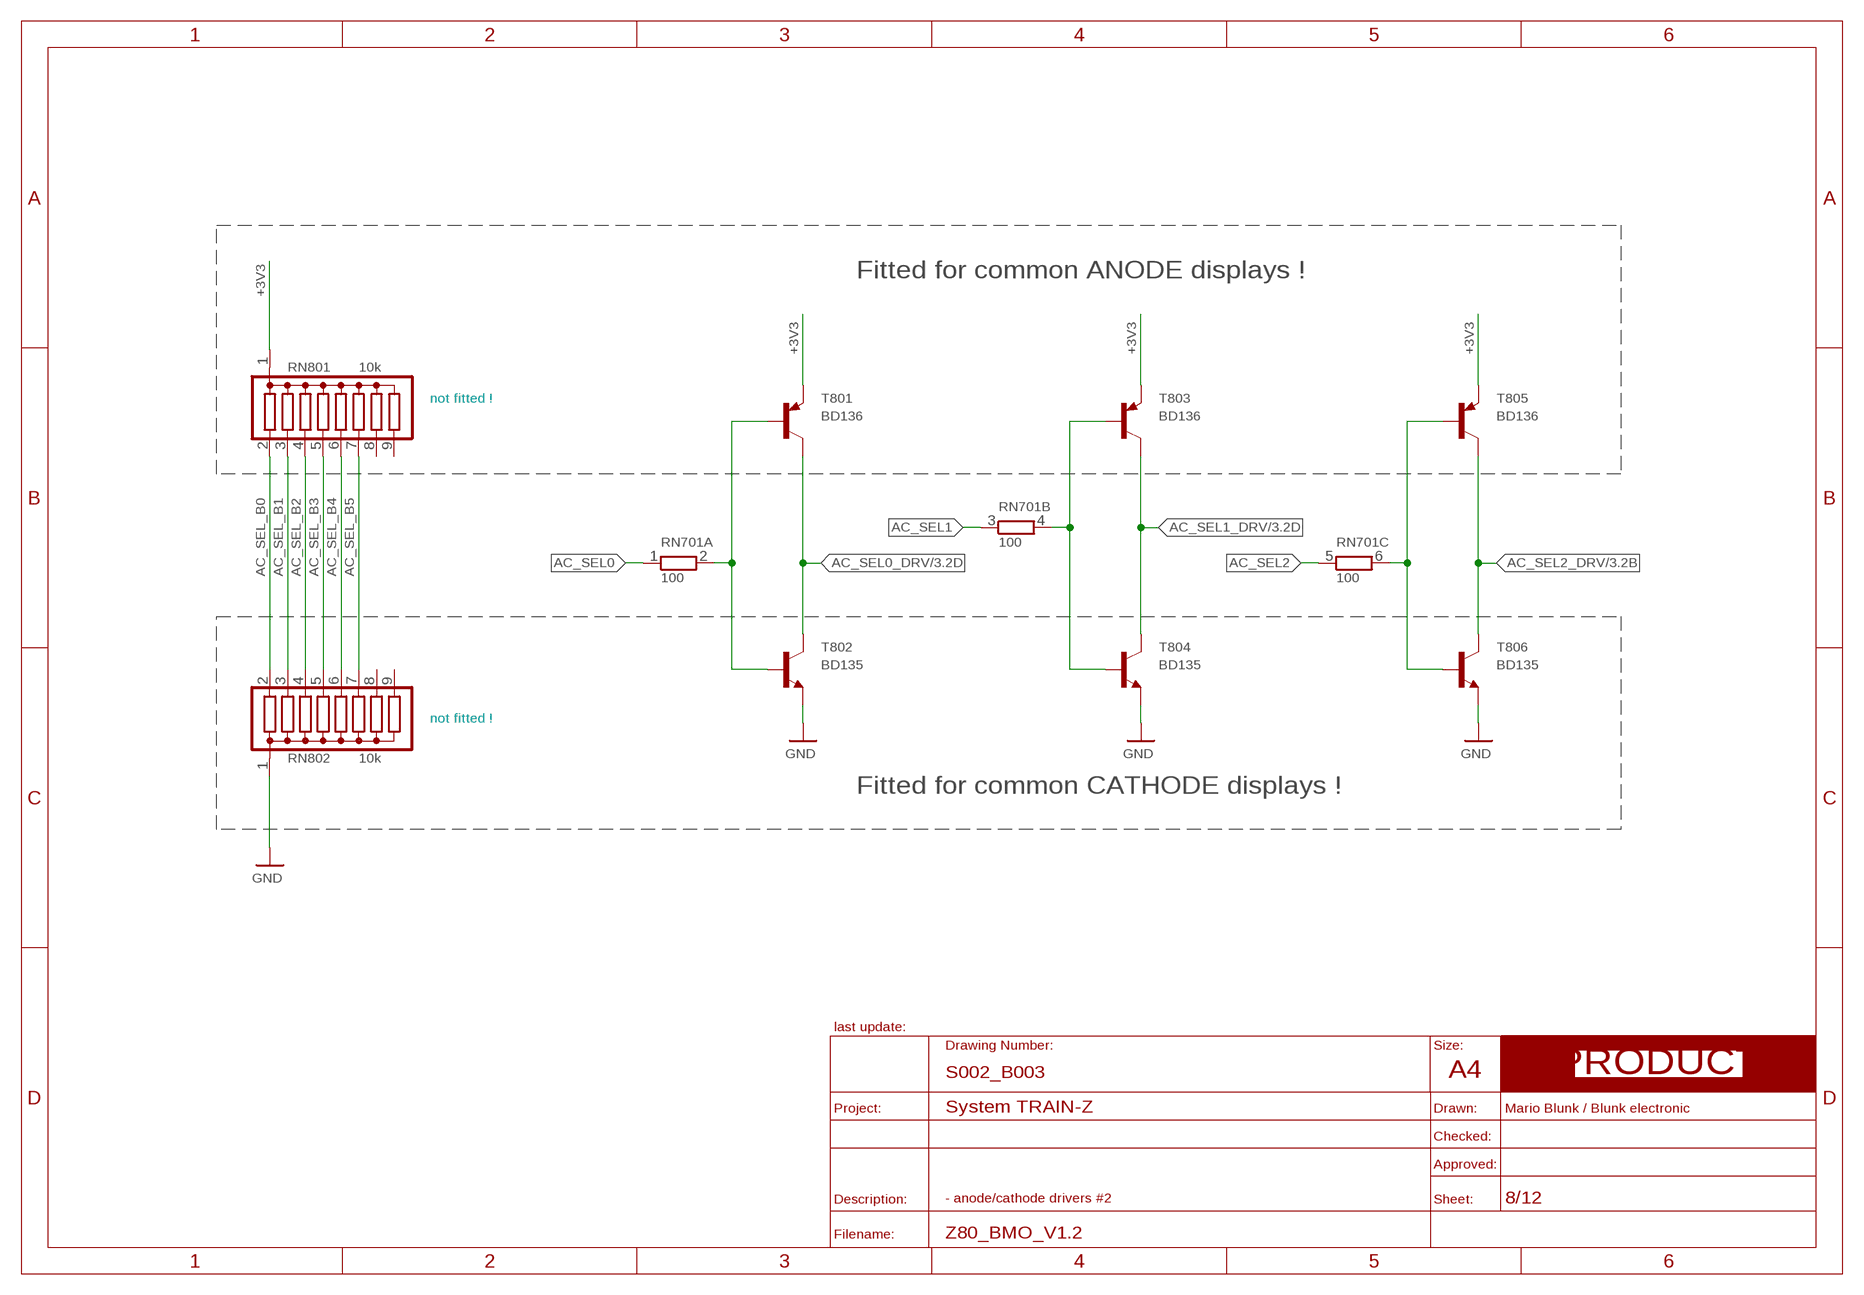
[diagram p7: schematic, sheet 8]
FRAME_PRODUCT9 (A4_LANDSCAPE_PRODUCT): BOM: NO; COMMISSIONED: 2013-08-30

### Parts
RN801  10k  R_EU_ARRAY_1C_8_T_SIL9  [T_SIL9]  (not fitted in variant com_anodes)  (not fitted in variant com_cathode)
RN802  10k  R_EU_ARRAY_1C_8_T_SIL9  [T_SIL9]  (not fitted in variant com_anodes)  (not fitted in variant com_cathode)
T801  BD136  PNP_T_TO126_VERTICAL  [T_TO126_VERTICAL]  (not fitted in variant com_cathode)
T802  BD135  NPN_T_TO126_VERTICAL  [T_TO126_VERTICAL]  (not fitted in variant com_anodes)
T803  BD136  PNP_T_TO126_VERTICAL  [T_TO126_VERTICAL]  (not fitted in variant com_cathode)
T804  BD135  NPN_T_TO126_VERTICAL  [T_TO126_VERTICAL]  (not fitted in variant com_anodes)
T805  BD136  PNP_T_TO126_VERTICAL  [T_TO126_VERTICAL]  (not fitted in variant com_cathode)
T806  BD135  NPN_T_TO126_VERTICAL  [T_TO126_VERTICAL]  (not fitted in variant com_anodes)

### Nets
+3V3: RN801.1 T801.E T803.E T805.E ; also sheet 1,2,4,5,6,7,9,10,11,12
AC_SEL0: RN701.1 ; also sheet 2
AC_SEL0_DRV [PWR]: T801.C T802.C ; also sheet 3
AC_SEL1: RN701.3 ; also sheet 2
AC_SEL1_DRV [PWR]: T803.C T804.C ; also sheet 3
AC_SEL2: RN701.5 ; also sheet 2
AC_SEL2_DRV [PWR]: T805.C T806.C ; also sheet 3
AC_SEL_B0: RN701.2 RN801.2 RN802.2 T801.B T802.B
AC_SEL_B1: RN701.4 RN801.3 RN802.3 T803.B T804.B
AC_SEL_B2: RN701.6 RN801.4 RN802.4 T805.B T806.B
AC_SEL_B3: RN801.5 RN802.5 ; also sheet 7
AC_SEL_B4: RN801.6 RN802.6 ; also sheet 7
AC_SEL_B5: RN801.7 RN802.7 ; also sheet 7
GND: RN802.1 T802.E T804.E T806.E ; also sheet 1,2,5,6,7,9,10,11,12
Unconnected: RN801.8 RN801.9 RN802.8 RN802.9

### Notes on the sheet
- Fitted for common ANODE displays !
- not fitted !
- not fitted !
- Fitted for common CATHODE displays !
- - anode/cathode drivers #2

## Sheet 9 of 12
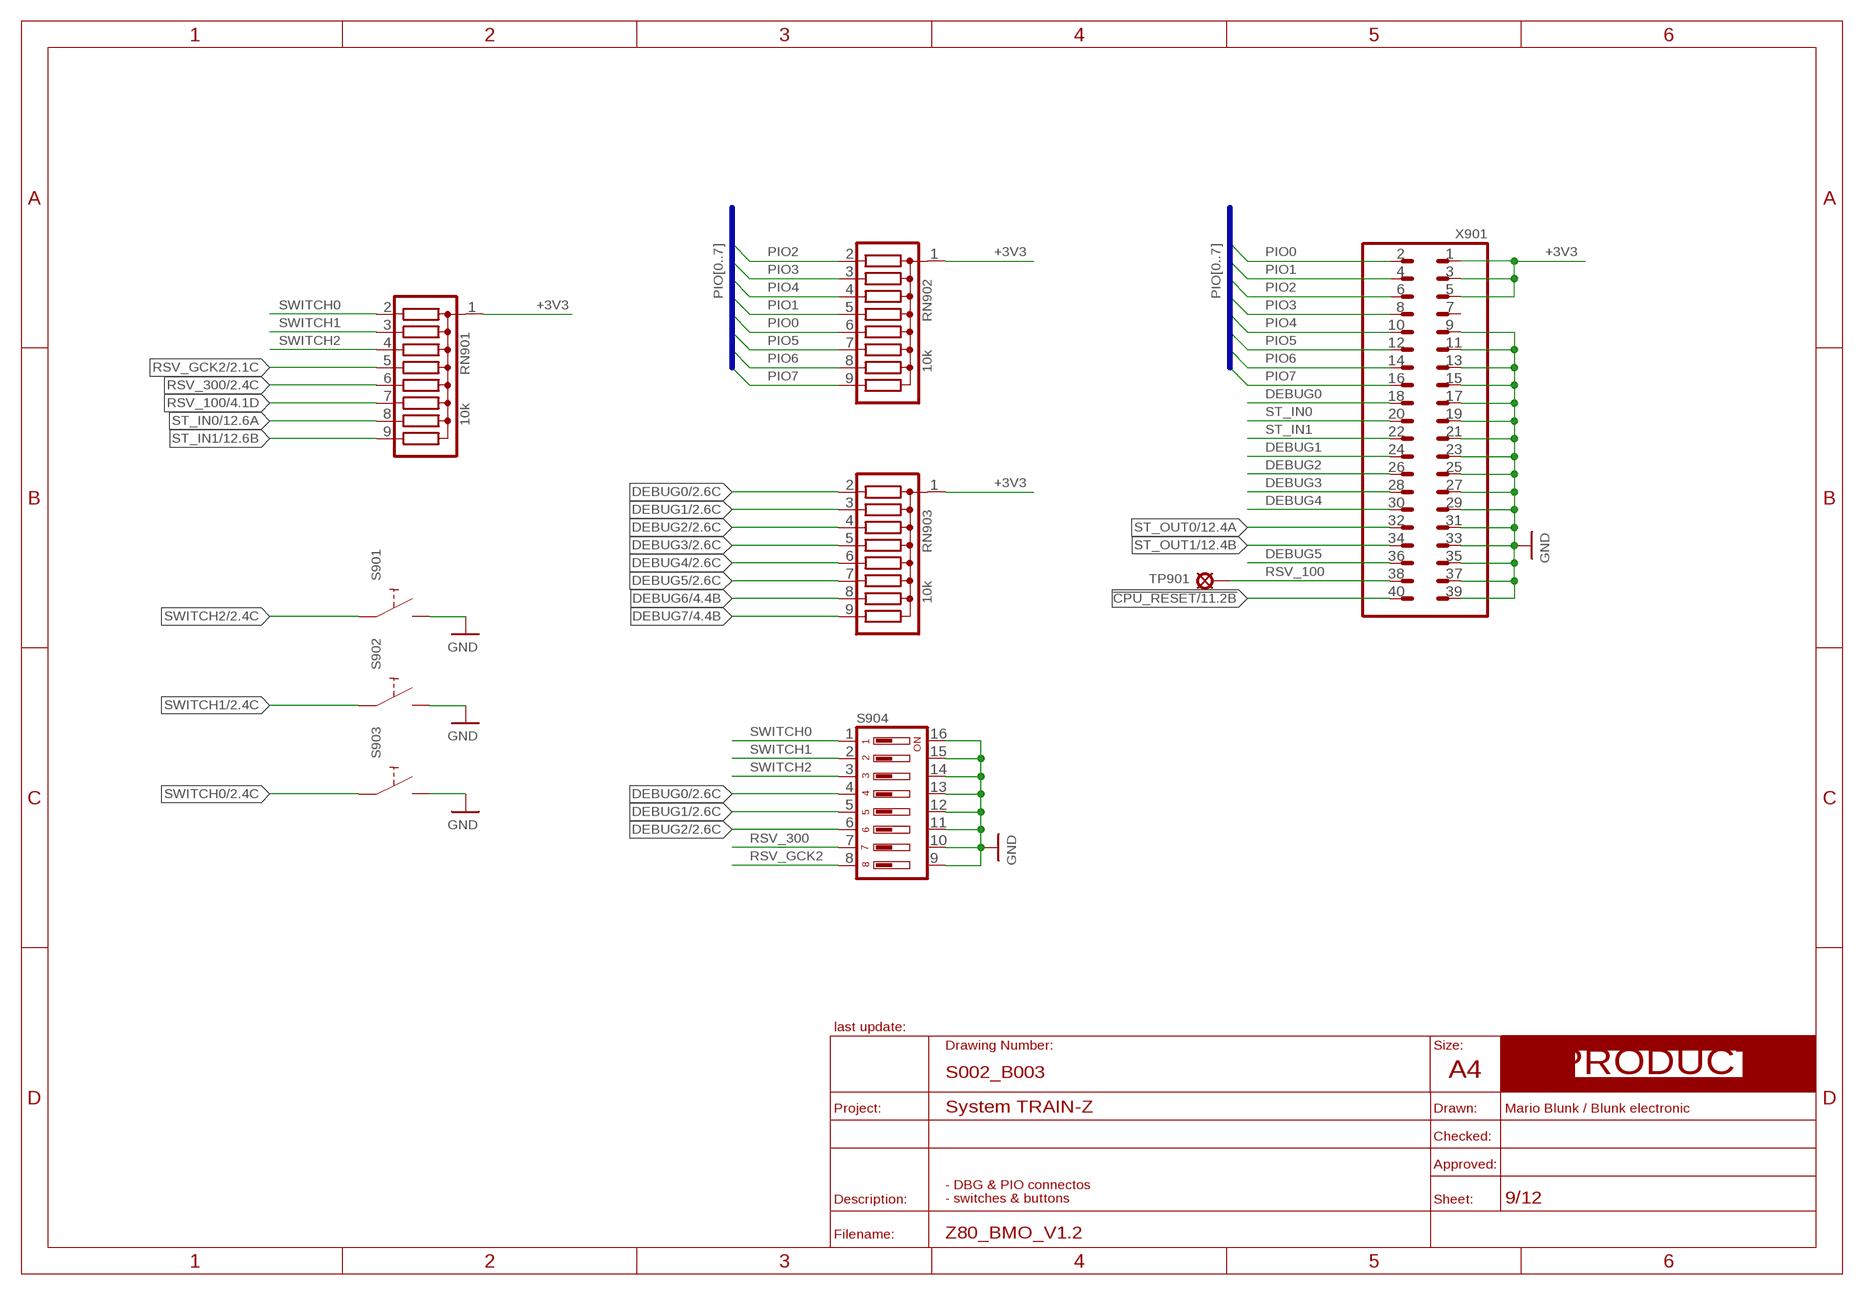
[diagram p8: schematic, sheet 9]
FRAME_PRODUCT12 (A4_LANDSCAPE_PRODUCT): BOM: NO; COMMISSIONED: 2013-08-30

### Parts
RN901  10k  R_EU_ARRAY_1C_8_T_SIL9  [T_SIL9]
RN902  10k  R_EU_ARRAY_1C_8_T_SIL9  [T_SIL9]
RN903  10k  R_EU_ARRAY_1C_8_T_SIL9  [T_SIL9]
S901  PUSH_BUTTON_T_6X6MM  [T_PUSH_BUTTON_6X6]
S902  PUSH_BUTTON_T_6X6MM  [T_PUSH_BUTTON_6X6]
S903  PUSH_BUTTON_T_6X6MM  [T_PUSH_BUTTON_6X6]
S904  DIP08  [T_DIP08]
TP901  TEST_POINT_T_SMALL  [T_TEST_POINT_SMALL]
X901  MALE_2X20-T-VERTICAL  [T_MALE_2X20_VERTICAL]

### Nets
!CPU_RESET: X901.40 ; also sheet 4,11
+3V3: RN901.1 RN902.1 RN903.1 X901.1 X901.3 X901.5 ; also sheet 1,2,4,5,6,7,8,10,11,12
DEBUG0: RN903.2 S904.4 X901.18 ; also sheet 2,4
DEBUG1: RN903.3 S904.5 X901.24 ; also sheet 2,4
DEBUG2: RN903.4 S904.6 X901.26 ; also sheet 2,4
DEBUG3: RN903.5 X901.28 ; also sheet 2,4
DEBUG4: RN903.6 X901.30 ; also sheet 2,4
DEBUG5: RN903.7 X901.36 ; also sheet 2,4
DEBUG6: RN903.8 ; also sheet 2,4
DEBUG7: RN903.9 ; also sheet 2,4
GND: S901.2(B1) S901.4(B1) S902.2(B1) S902.4(B1) S903.2(B1) S903.4(B1) S904.9 S904.10 S904.11 S904.12 S904.13 S904.14 S904.15 S904.16 X901.9 X901.11 X901.13 X901.15 X901.17 X901.19 X901.21 X901.23 X901.25 X901.27 X901.29 X901.31 X901.33 X901.35 X901.37 X901.39 ; also sheet 1,2,5,6,7,8,10,11,12
PIO0: RN902.6 X901.2 ; also sheet 2
PIO1: RN902.5 X901.4 ; also sheet 2
PIO2: RN902.2 X901.6 ; also sheet 2
PIO3: RN902.3 X901.8 ; also sheet 2
PIO4: RN902.4 X901.10 ; also sheet 2
PIO5: RN902.7 X901.12 ; also sheet 2
PIO6: RN902.8 X901.14 ; also sheet 2
PIO7: RN902.9 X901.16 ; also sheet 2
RSV_100: RN901.7 TP901.1(MP) X901.38 ; also sheet 4
RSV_300: RN901.6 S904.7 ; also sheet 2
RSV_GCK2: RN901.5 S904.8 ; also sheet 2
ST_IN0: RN901.8 X901.20 ; also sheet 12
ST_IN1: RN901.9 X901.22 ; also sheet 12
ST_OUT0: X901.32 ; also sheet 12
ST_OUT1: X901.34 ; also sheet 12
SWITCH0: RN901.2 S903.1(A1) S903.3(A1) S904.1 ; also sheet 2
SWITCH1: RN901.3 S902.1(A1) S902.3(A1) S904.2 ; also sheet 2
SWITCH2: RN901.4 S901.1(A1) S901.3(A1) S904.3 ; also sheet 2
Unconnected: X901.7

### Buses
PIO[0..7]

### Notes on the sheet
- - DBG & PIO connectos
  - switches & buttons

## Sheet 10 of 12
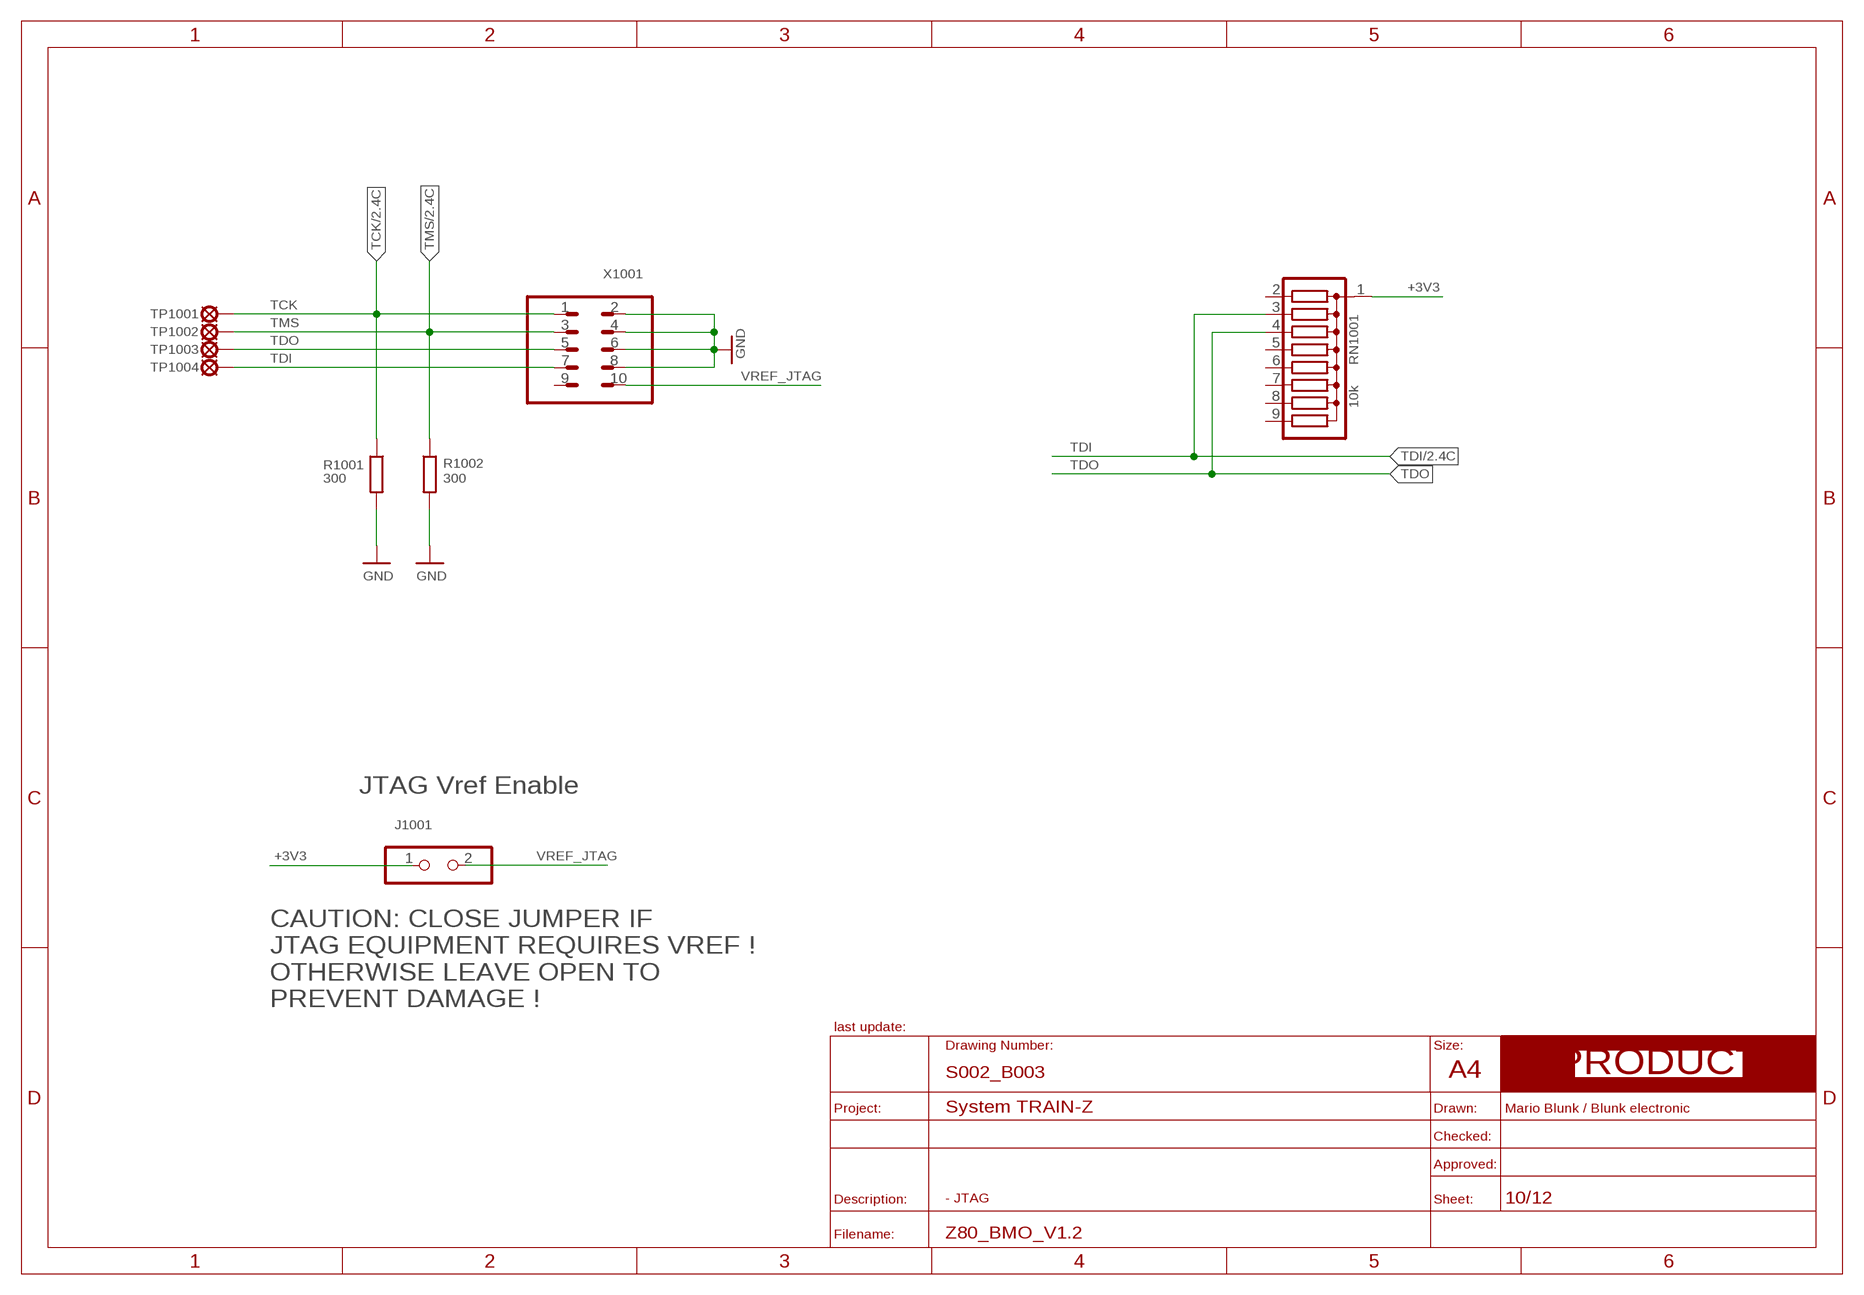
[diagram p9: schematic, sheet 10]
FRAME_PRODUCT3 (A4_LANDSCAPE_PRODUCT): BOM: NO; COMMISSIONED: 2013-08-30

### Parts
J1001  JUMPER_1X2-T-VERTICAL  [T_MALE_2X1_VERTICAL]
R1001  300  R_EU_T_0207_GRID10MM  [T_0207_GRID10MM]
R1002  300  R_EU_T_0207_GRID10MM  [T_0207_GRID10MM]
RN1001  10k  R_EU_ARRAY_1C_8_T_SIL9  [T_SIL9]
TP1001  TEST_POINT_T_SMALL  [T_TEST_POINT_SMALL]
TP1002  TEST_POINT_T_SMALL  [T_TEST_POINT_SMALL]
TP1003  TEST_POINT_T_SMALL  [T_TEST_POINT_SMALL]
TP1004  TEST_POINT_T_SMALL  [T_TEST_POINT_SMALL]
X1001  MALE_2X5-T-VERTICAL_2.54MM  [T_MALE_2X5_VERTICAL]

### Nets
+3V3: J1001.1 RN1001.1 ; also sheet 1,2,4,5,6,7,8,9,11,12
GND: R1001.2 R1002.2 X1001.2 X1001.4 X1001.6 X1001.8 ; also sheet 1,2,5,6,7,8,9,11,12
TCK: R1001.1 TP1001.1(MP) X1001.1 ; also sheet 2
TDI: RN1001.3 TP1004.1(MP) X1001.7 ; also sheet 2
TDO: RN1001.4 TP1003.1(MP) X1001.5 ; also sheet 2
TMS: R1002.1 TP1002.1(MP) X1001.3 ; also sheet 2
VREF_JTAG: J1001.2 X1001.10
Unconnected: RN1001.2 RN1001.5 RN1001.6 RN1001.7 RN1001.8 RN1001.9 X1001.9

### Notes on the sheet
- CAUTION: CLOSE JUMPER IF
  JTAG EQUIPMENT REQUIRES VREF !
  OTHERWISE LEAVE OPEN TO
  PREVENT DAMAGE !
- - JTAG

## Sheet 11 of 12
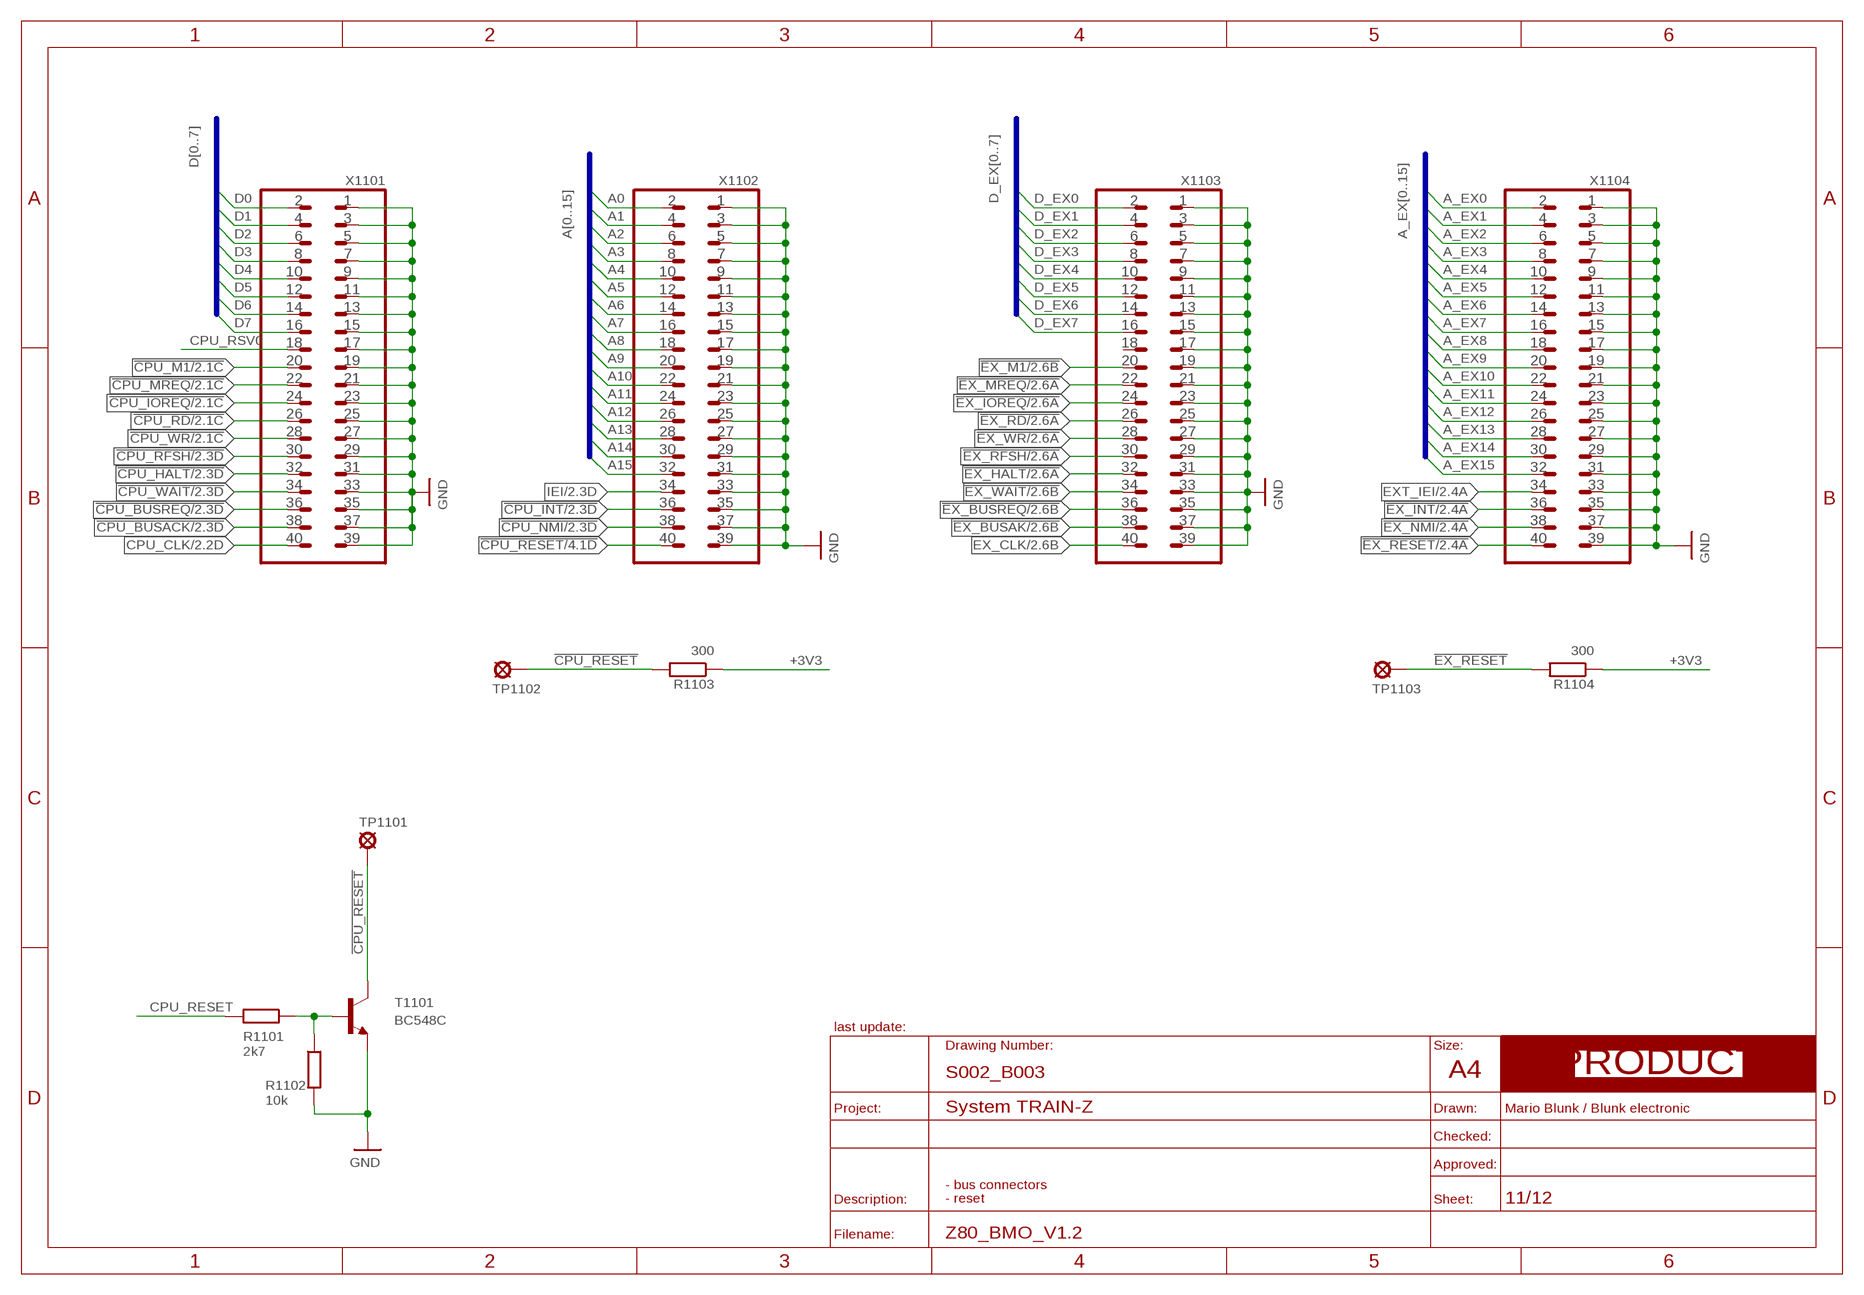
[diagram p10: schematic, sheet 11]
FRAME_PRODUCT2 (A4_LANDSCAPE_PRODUCT): BOM: NO; COMMISSIONED: 2013-08-30

### Parts
R1101  2k7  R_EU_T_0207_GRID10MM  [T_0207_GRID10MM]
R1102  10k  R_EU_T_0207_GRID10MM  [T_0207_GRID10MM]
R1103  300  R_EU_T_0207_GRID10MM  [T_0207_GRID10MM]
R1104  300  R_EU_T_0207_GRID10MM  [T_0207_GRID10MM]
T1101  BC548C  NPN_T_TO92-CBE  [T_TO92-CBE]
TP1101  TEST_POINT_T_SMALL  [T_TEST_POINT_SMALL]
TP1102  TEST_POINT_T_SMALL  [T_TEST_POINT_SMALL]
TP1103  TEST_POINT_T_SMALL  [T_TEST_POINT_SMALL]
X1101  MALE_2X20-T-VERTICAL  [T_MALE_2X20_VERTICAL]
X1102  MALE_2X20-T-VERTICAL  [T_MALE_2X20_VERTICAL]
X1103  MALE_2X20-T-VERTICAL  [T_MALE_2X20_VERTICAL]
X1104  MALE_2X20-T-VERTICAL  [T_MALE_2X20_VERTICAL]

### Nets
!CPU_BUSACK: X1101.38 ; also sheet 2
!CPU_BUSREQ: X1101.36 ; also sheet 2
!CPU_HALT: X1101.32 ; also sheet 2
!CPU_INT: X1102.36 ; also sheet 2
!CPU_IOREQ: X1101.24 ; also sheet 2
!CPU_M1: X1101.20 ; also sheet 2
!CPU_MREQ: X1101.22 ; also sheet 2
!CPU_NMI: X1102.38 ; also sheet 2
!CPU_RD: X1101.26 ; also sheet 2
!CPU_RESET: R1103.2 T1101.C TP1101.1(MP) TP1102.1(MP) X1102.40 ; also sheet 4,9
!CPU_RFSH: X1101.30 ; also sheet 2
!CPU_WAIT: X1101.34 ; also sheet 2
!CPU_WR: X1101.28 ; also sheet 2
!EX_BUSAK: X1103.38 ; also sheet 2
!EX_BUSREQ: X1103.36 ; also sheet 2
!EX_HALT: X1103.32 ; also sheet 2
!EX_INT: X1104.36 ; also sheet 2
!EX_IOREQ: X1103.24 ; also sheet 2
!EX_M1: X1103.20 ; also sheet 2
!EX_MREQ: X1103.22 ; also sheet 2
!EX_NMI: X1104.38 ; also sheet 2
!EX_RD: X1103.26 ; also sheet 2
!EX_RESET: R1104.2 TP1103.1(MP) X1104.40 ; also sheet 2
!EX_RFSH: X1103.30 ; also sheet 2
!EX_WAIT: X1103.34 ; also sheet 2
!EX_WR: X1103.28 ; also sheet 2
+3V3: R1103.1 R1104.1 ; also sheet 1,2,4,5,6,7,8,9,10,12
A0: X1102.2 ; also sheet 2
A1: X1102.4 ; also sheet 2
A2: X1102.6 ; also sheet 2
A3: X1102.8 ; also sheet 2
A4: X1102.10 ; also sheet 2
A5: X1102.12 ; also sheet 2
A6: X1102.14 ; also sheet 2
A7: X1102.16 ; also sheet 2
A8: X1102.18 ; also sheet 2
A9: X1102.20 ; also sheet 2
A10: X1102.22 ; also sheet 2
A11: X1102.24 ; also sheet 2
A12: X1102.26 ; also sheet 2
A13: X1102.28 ; also sheet 2
A14: X1102.30 ; also sheet 2
A15: X1102.32 ; also sheet 2
A_EX0: X1104.2 ; also sheet 2
A_EX1: X1104.4 ; also sheet 2
A_EX2: X1104.6 ; also sheet 2
A_EX3: X1104.8 ; also sheet 2
A_EX4: X1104.10 ; also sheet 2
A_EX5: X1104.12 ; also sheet 2
A_EX6: X1104.14 ; also sheet 2
A_EX7: X1104.16 ; also sheet 2
A_EX8: X1104.18 ; also sheet 2
A_EX9: X1104.20 ; also sheet 2
A_EX10: X1104.22 ; also sheet 2
A_EX11: X1104.24 ; also sheet 2
A_EX12: X1104.26 ; also sheet 2
A_EX13: X1104.28 ; also sheet 2
A_EX14: X1104.30 ; also sheet 2
A_EX15: X1104.32 ; also sheet 2
CPU_CLK: X1101.40 ; also sheet 2
CPU_RESET: R1101.2 ; also sheet 2
CPU_RESET_B: R1101.1 R1102.1 T1101.B
CPU_RSV0: X1101.18
D0: X1101.2 ; also sheet 2
D1: X1101.4 ; also sheet 2
D2: X1101.6 ; also sheet 2
D3: X1101.8 ; also sheet 2
D4: X1101.10 ; also sheet 2
D5: X1101.12 ; also sheet 2
D6: X1101.14 ; also sheet 2
D7: X1101.16 ; also sheet 2
D_EX0: X1103.2 ; also sheet 2
D_EX1: X1103.4 ; also sheet 2
D_EX2: X1103.6 ; also sheet 2
D_EX3: X1103.8 ; also sheet 2
D_EX4: X1103.10 ; also sheet 2
D_EX5: X1103.12 ; also sheet 2
D_EX6: X1103.14 ; also sheet 2
D_EX7: X1103.16 ; also sheet 2
EX_CLK: X1103.40 ; also sheet 2
EXT_IEI: X1104.34 ; also sheet 2
GND: R1102.2 T1101.E X1101.1 X1101.3 X1101.5 X1101.7 X1101.9 X1101.11 X1101.13 X1101.15 X1101.17 X1101.19 X1101.21 X1101.23 X1101.25 X1101.27 X1101.29 X1101.31 X1101.33 X1101.35 X1101.37 X1101.39 X1102.1 X1102.3 X1102.5 X1102.7 X1102.9 X1102.11 X1102.13 X1102.15 X1102.17 X1102.19 X1102.21 X1102.23 X1102.25 X1102.27 X1102.29 X1102.31 X1102.33 X1102.35 X1102.37 X1102.39 X1103.1 X1103.3 X1103.5 X1103.7 X1103.9 X1103.11 X1103.13 X1103.15 X1103.17 X1103.19 X1103.21 X1103.23 X1103.25 X1103.27 X1103.29 X1103.31 X1103.33 X1103.35 X1103.37 X1103.39 X1104.1 X1104.3 X1104.5 X1104.7 X1104.9 X1104.11 X1104.13 X1104.15 X1104.17 X1104.19 X1104.21 X1104.23 X1104.25 X1104.27 X1104.29 X1104.31 X1104.33 X1104.35 X1104.37 X1104.39 ; also sheet 1,2,5,6,7,8,9,10,12
IEI: X1102.34 ; also sheet 2
Unconnected: X1103.18

### Buses
D[0..7]
A[0..15]
D_EX[0..7]
A_EX[0..15]

### Notes on the sheet
- - bus connectors
  - reset

## Sheet 12 of 12
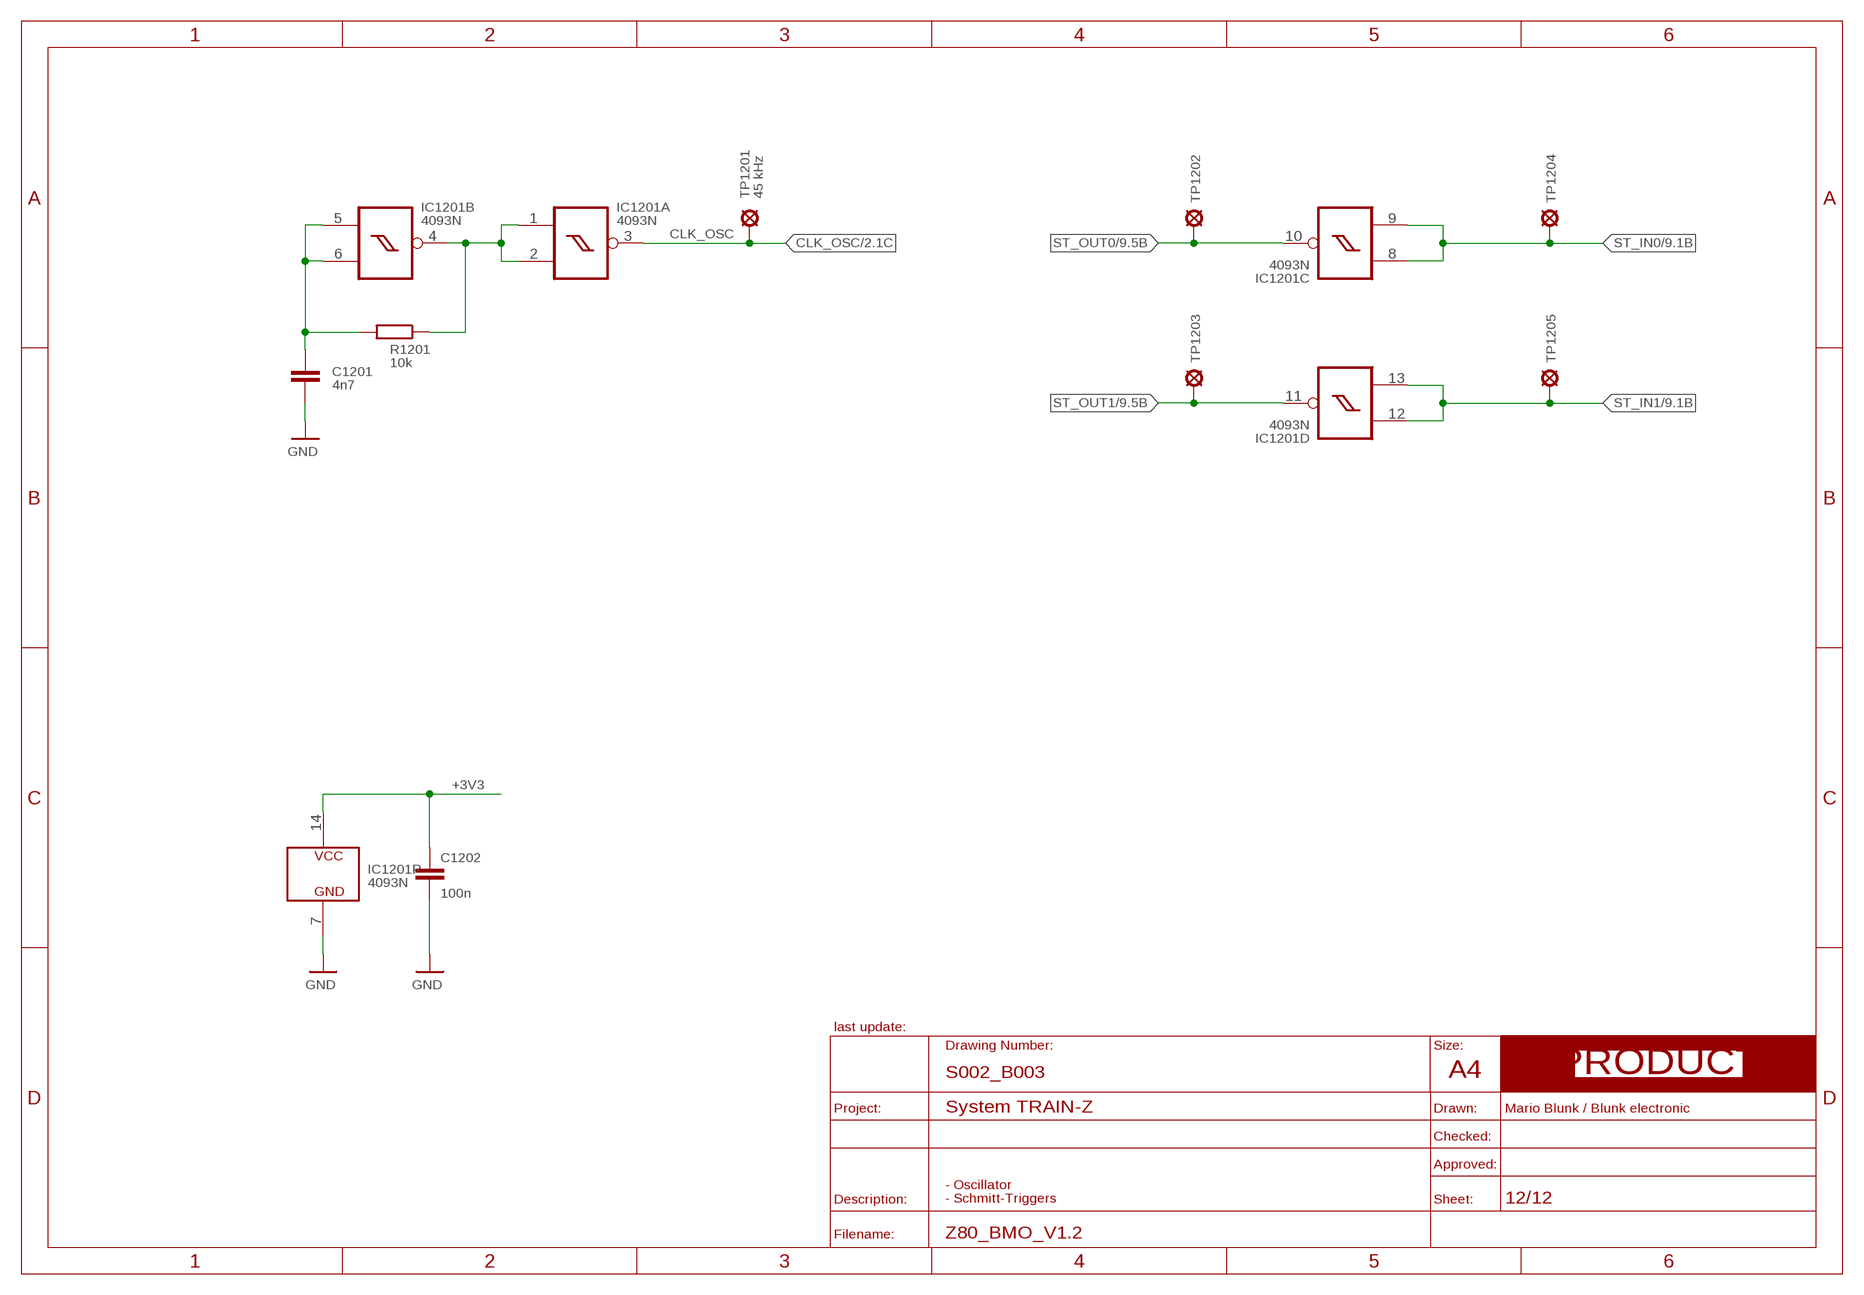
[diagram p11: schematic, sheet 12]
FRAME_PRODUCT11 (A4_LANDSCAPE_PRODUCT): BOM: NO; COMMISSIONED: 2013-08-30

### Parts
C1201  4n7  C_EU_S_7X3MM_GRID_5MM  [T_7X3MM_GRID_5MM]
C1202  100n  C_EU_S_0805  [S_0805]
IC1201  4093N  [T_NDIP14]
R1201  10k  R_EU_T_0207_GRID10MM  [T_0207_GRID10MM]
TP1201  TEST_POINT_T_SMALL  [T_TEST_POINT_SMALL]
TP1202  TEST_POINT_T_SMALL  [T_TEST_POINT_SMALL]
TP1203  TEST_POINT_T_SMALL  [T_TEST_POINT_SMALL]
TP1204  TEST_POINT_T_SMALL  [T_TEST_POINT_SMALL]
TP1205  TEST_POINT_T_SMALL  [T_TEST_POINT_SMALL]

### Nets
+3V3: C1202.1 IC1201.14(P:VCC) ; also sheet 1,2,4,5,6,7,8,9,10,11
CLK_OSC: IC1201.3(A:O) TP1201.1(MP) ; also sheet 2
CLK_SLOW: IC1201.1(A:I0) IC1201.2(A:I1) IC1201.4(B:O) R1201.1
GND: C1201.2 C1202.2 IC1201.7(P:GND) ; also sheet 1,2,5,6,7,8,9,10,11
N$78: C1201.1 IC1201.5(B:I0) IC1201.6(B:I1) R1201.2
ST_IN0: IC1201.8(C:I0) IC1201.9(C:I1) TP1204.1(MP) ; also sheet 9
ST_IN1: IC1201.12(D:I0) IC1201.13(D:I1) TP1205.1(MP) ; also sheet 9
ST_OUT0: IC1201.10(C:O) TP1202.1(MP) ; also sheet 9
ST_OUT1: IC1201.11(D:O) TP1203.1(MP) ; also sheet 9

### Notes on the sheet
- 45 kHz
- - Oscillator
  - Schmitt-Triggers

## Library data of the parts
C101-C108 C110 C111 C1202 = be_rcl:C_EU: drawn: Mario Blunk / Blunk electronic; BOM: YES; COMMISSIONED: 2013-08-30; PART_CODE_BEL: C_PAC_S_0805_VAL_100n
C109 C112 = be_rcl:C_POL_EU: drawn: Mario Blunk / Blunk electronic; BOM: YES; COMMISSIONED: 2014-10-13; PART_CODE_BEL: C_PAC_T_RADIAL_7mm_GRID_2.54mm_VAL_100u_Vmax_35V
C1201 = be_rcl:C_EU: drawn: Mario Blunk / Blunk electronic; BOM: YES; COMMISSIONED: 2014-10-14; PART_CODE_BEL: C_PAC_T_7x3mm_GRID_5mm_VAL_4n7
D101 = be_opt:LED: single LED device drawn: Mario Blunk / Blunk electronic; BOM: YES; COMMISSIONED: 2014-10-14; FUNCTION: +3V3; PART_CODE_BEL: LED_PAC_T_3mm_VAL_green
D401 = be_opt:LED: single LED device drawn: Mario Blunk / Blunk electronic; BOM: YES; COMMISSIONED: 2014-10-14; FUNCTION: IEI; PART_CODE_BEL: LED_PAC_T_3mm_VAL_green
D402 = be_opt:LED: single LED device drawn: Mario Blunk / Blunk electronic; BOM: YES; COMMISSIONED: 2014-10-14; FUNCTION: RSVD; PART_CODE_BEL: LED_PAC_T_3mm_VAL_green
D403 = be_opt:LED: single LED device drawn: Mario Blunk / Blunk electronic; BOM: YES; COMMISSIONED: 2014-10-14; FUNCTION: NMI; PART_CODE_BEL: LED_PAC_T_3mm_VAL_green
D404 = be_opt:LED: single LED device drawn: Mario Blunk / Blunk electronic; BOM: YES; COMMISSIONED: 2014-10-14; FUNCTION: RST; PART_CODE_BEL: LED_PAC_T_3mm_VAL_red
D405 = be_opt:LED: single LED device drawn: Mario Blunk / Blunk electronic; BOM: YES; COMMISSIONED: 2014-10-14; FUNCTION: INT; PART_CODE_BEL: LED_PAC_T_3mm_VAL_green
D406 = be_opt:LED: single LED device drawn: Mario Blunk / Blunk electronic; BOM: YES; COMMISSIONED: 2014-10-14; FUNCTION: M1; PART_CODE_BEL: LED_PAC_T_3mm_VAL_green
D407 = be_opt:LED: single LED device drawn: Mario Blunk / Blunk electronic; BOM: YES; COMMISSIONED: 2014-10-14; FUNCTION: IORQ; PART_CODE_BEL: LED_PAC_T_3mm_VAL_green
D408 = be_opt:LED: single LED device drawn: Mario Blunk / Blunk electronic; BOM: YES; COMMISSIONED: 2014-10-14; FUNCTION: MRQ; PART_CODE_BEL: LED_PAC_T_3mm_VAL_green
D409 = be_opt:LED: single LED device drawn: Mario Blunk / Blunk electronic; BOM: YES; COMMISSIONED: 2014-10-14; FUNCTION: WR; PART_CODE_BEL: LED_PAC_T_3mm_VAL_green
D410 = be_opt:LED: single LED device drawn: Mario Blunk / Blunk electronic; BOM: YES; COMMISSIONED: 2014-10-14; FUNCTION: RD; PART_CODE_BEL: LED_PAC_T_3mm_VAL_green
D411 = be_opt:LED: single LED device drawn: Mario Blunk / Blunk electronic; BOM: YES; COMMISSIONED: 2014-10-14; FUNCTION: HALT; PART_CODE_BEL: LED_PAC_T_3mm_VAL_green
D412 = be_opt:LED: single LED device drawn: Mario Blunk / Blunk electronic; BOM: YES; COMMISSIONED: 2014-10-14; FUNCTION: WAIT; PART_CODE_BEL: LED_PAC_T_3mm_VAL_green
D413 = be_opt:LED: single LED device drawn: Mario Blunk / Blunk electronic; BOM: YES; COMMISSIONED: 2014-10-14; FUNCTION: BSAK; PART_CODE_BEL: LED_PAC_T_3mm_VAL_green
D414 = be_opt:LED: single LED device drawn: Mario Blunk / Blunk electronic; BOM: YES; COMMISSIONED: 2014-10-14; FUNCTION: BSRQ; PART_CODE_BEL: LED_PAC_T_3mm_VAL_green
DIS301 DIS303 = be_opt:VQEXX_2DIGIT: edited: Mario Blunk; BOM: YES; COMMISSIONED: 2014-10-14; PART_CODE_BEL: DIS_T_PAC_VQExx_2DIGIT_VAL_VQE24
DIS302 = be_opt:VQEXX_2DIGIT: edited: Mario Blunk; BOM: YES; COMMISSIONED: 2014-10-14; PART_CODE_BEL: DIS_T_PAC_VQExx_2DIGIT_VAL_VQE14
FD101 FD102 = be_marks:FIDUCIAL: drawn: Mario Blunk / Blunk electronic; BOM: NO; COMMISSIONED: 2013-12-03
H101-H104 = be_holes:HOLE: edited: Mario Blunk; BOM: NO; COMMISSIONED: 2014-10-13
IC201 = be_xilinx:XC95288XL: edited: Mario Blunk; BOM: YES; COMMISSIONED: 2014-10-13; PART_CODE_BEL: IC_PAC_S_TQFP144_VAL_XC95288XL-xTQ144x
IC1201 = be_logic:4093: drawn: Mario Blunk / Blunk electronic; BOM: YES; COMMISSIONED: 2014-09-06; PART_CODE_BEL: IC_PAC_T_NDIP14_VAL_4093N
J1001 = be_con_jump:JUMPER_1X2: jumper device 1x2 drawn: Mario Blunk / Blunk electronic; BOM: YES; COMMISSIONED: 2013-08-30; FUNCTION: JTAG Vref Enable; PART_CODE_BEL: J_PAC_T_MALE_2X1_VERTICAL
R101 R401-R414 = be_rcl:R_EU: Resistor Device EU drawn: Mario Blunk / Blunk electronic; BOM: YES; COMMISSIONED: 2014-10-13; PART_CODE_BEL: R_PAC_T_0207_GRID10mm_VAL_160
R301-R307 = be_rcl:R_EU: Resistor Device EU drawn: Mario Blunk / Blunk electronic; BOM: YES; COMMISSIONED: 2014-10-13; PART_CODE_BEL: R_PAC_T_0207_GRID10mm_VAL_10
R1001 R1002 R1103 R1104 = be_rcl:R_EU: Resistor Device EU drawn: Mario Blunk / Blunk electronic; BOM: YES; COMMISSIONED: 2014-10-13; PART_CODE_BEL: R_PAC_T_0207_GRID10mm_VAL_300
R1101 = be_rcl:R_EU: Resistor Device EU drawn: Mario Blunk / Blunk electronic; BOM: YES; COMMISSIONED: 2014-10-13; PART_CODE_BEL: R_PAC_T_0207_GRID10mm_VAL_2k7
R1102 R1201 = be_rcl:R_EU: Resistor Device EU drawn: Mario Blunk / Blunk electronic; BOM: YES; COMMISSIONED: 2014-10-13; PART_CODE_BEL: R_PAC_T_0207_GRID10mm_VAL_10k
RN501 RN502 RN801 RN802 RN901-RN903 RN1001 = be_rcl:R_EU_ARRAY_1C_8: edited: Mario Blunk; BOM: YES; COMMISSIONED: 2014-10-14; PART_CODE_BEL: RN_PAC_T_SIL9_VAL_10k
RN503 RN601 = be_rcl:R_EU_ARRAY_4: edited: Mario Blunk; BOM: YES; COMMISSIONED: 2014-10-14; PART_CODE_BEL: RN_PAC_T_SIL8_VAL_2k7
RN701 RN702 = be_rcl:R_EU_ARRAY_4: edited: Mario Blunk; BOM: YES; COMMISSIONED: 2014-10-14; PART_CODE_BEL: RN_PAC_T_SIL8_VAL_100
S901-S903 = be_switch:PUSH_BUTTON: edited: Mario Blunk; BOM: YES; COMMISSIONED: 2014-10-14; PART_CODE_BEL: T_PAC_T_PUSH_BUTTON_6X6
S904 = be_switch:DIP08: edited: Mario Blunk; BOM: YES; COMMISSIONED: 2014-10-14; PART_CODE_BEL: S_PAC_T_DIP08
T501 T503 T505 T507 T601 T603 T605 = be_transistor:PNP: edited: Mario Blunk; BOM: YES; COMMISSIONED: 2014-10-14; PART_CODE_BEL: T_PAC_T_TO92-CBE_VAL_BC327
T502 T504 T506 T508 T602 T604 T606 T1101 = be_transistor:NPN: edited: Mario Blunk; BOM: YES; COMMISSIONED: 2014-10-14; PART_CODE_BEL: T_PAC_T_TO92-CBE_VAL_BC548C
T701 T703 T705 T801 T803 T805 = be_transistor:PNP: edited: Mario Blunk; BOM: YES; COMMISSIONED: 2014-10-14; PART_CODE_BEL: T_PAC_T_TO126_VERTICAL_VAL_BD136
T702 T704 T706 T802 T804 T806 = be_transistor:NPN: edited: Mario Blunk; BOM: YES; COMMISSIONED: 2014-10-14; PART_CODE_BEL: T_PAC_T_TO126_VERTICAL_VAL_BD135
TP101-TP136 TP201 TP301-TP306 TP901 TP1001-TP1004 TP1101-TP1103 TP1201-TP1205 = be_con_jump:TEST_POINT: test point device drawn: Mario Blunk / Blunk electronic; BOM: NO; COMMISSIONED: 2013-08-30; PART_CODE_BEL: TP_PAC_T_TEST_POINT_SMALL
X101 = be_con_jump:CLAMP_1X4: drawn: Mario Blunk / Blunk electronic; BOM: YES; COMMISSIONED: 2014-02-26; FUNCTION: Power Supply Input; PART_CODE_BEL: X_PAC_T_CLAMP_1X4_5mm
X901 = be_con_jump:MALE_2X20: drawn: Mario Blunk / Blunk electronic; BOM: YES; COMMISSIONED: 2014-10-14; FUNCTION: PIO_DBG; PART_CODE_BEL: X_PAC_T_MALE_2X20_VERTICAL
X1001 = be_con_jump:MALE_2X5: drawn: Mario Blunk / Blunk electronic; BOM: YES; COMMISSIONED: 2013-12-16; PART_CODE_BEL: X_PAC_T_MALE_2X5_VERTICAL_2.54mm
X1101 = be_con_jump:MALE_2X20: drawn: Mario Blunk / Blunk electronic; BOM: YES; COMMISSIONED: 2014-10-14; FUNCTION: CPU_CTRL&DATA; PART_CODE_BEL: X_PAC_T_MALE_2X20_VERTICAL
X1102 = be_con_jump:MALE_2X20: drawn: Mario Blunk / Blunk electronic; BOM: YES; COMMISSIONED: 2014-10-14; FUNCTION: CPU_CTRL&ADDR; PART_CODE_BEL: X_PAC_T_MALE_2X20_VERTICAL
X1103 = be_con_jump:MALE_2X20: drawn: Mario Blunk / Blunk electronic; BOM: YES; COMMISSIONED: 2014-10-14; FUNCTION: EXT_CTRL&DATA; PART_CODE_BEL: X_PAC_T_MALE_2X20_VERTICAL
X1104 = be_con_jump:MALE_2X20: drawn: Mario Blunk / Blunk electronic; BOM: YES; COMMISSIONED: 2014-10-14; FUNCTION: EXT_CTRL&ADDR; PART_CODE_BEL: X_PAC_T_MALE_2X20_VERTICAL